# EasyEDA Pro project ProDoc_dogo-Lab_esp32c3_电激器shockerMini_V1.2_2025-11-26.epro

# Schematic Schematic3

## Sheets
1 主控部分c3: Board Name: dogo-Lab_esp32c3_电激器shockerMini_V1; Create Date: 2025-03-03; Page Name: 主控部分c3; Project Name: 都狗lab; Schematic Name: Schematic3; Update Date: 2025-11-17; Company: 嘉立创EDA; Page Size: A4; Version: V1.0
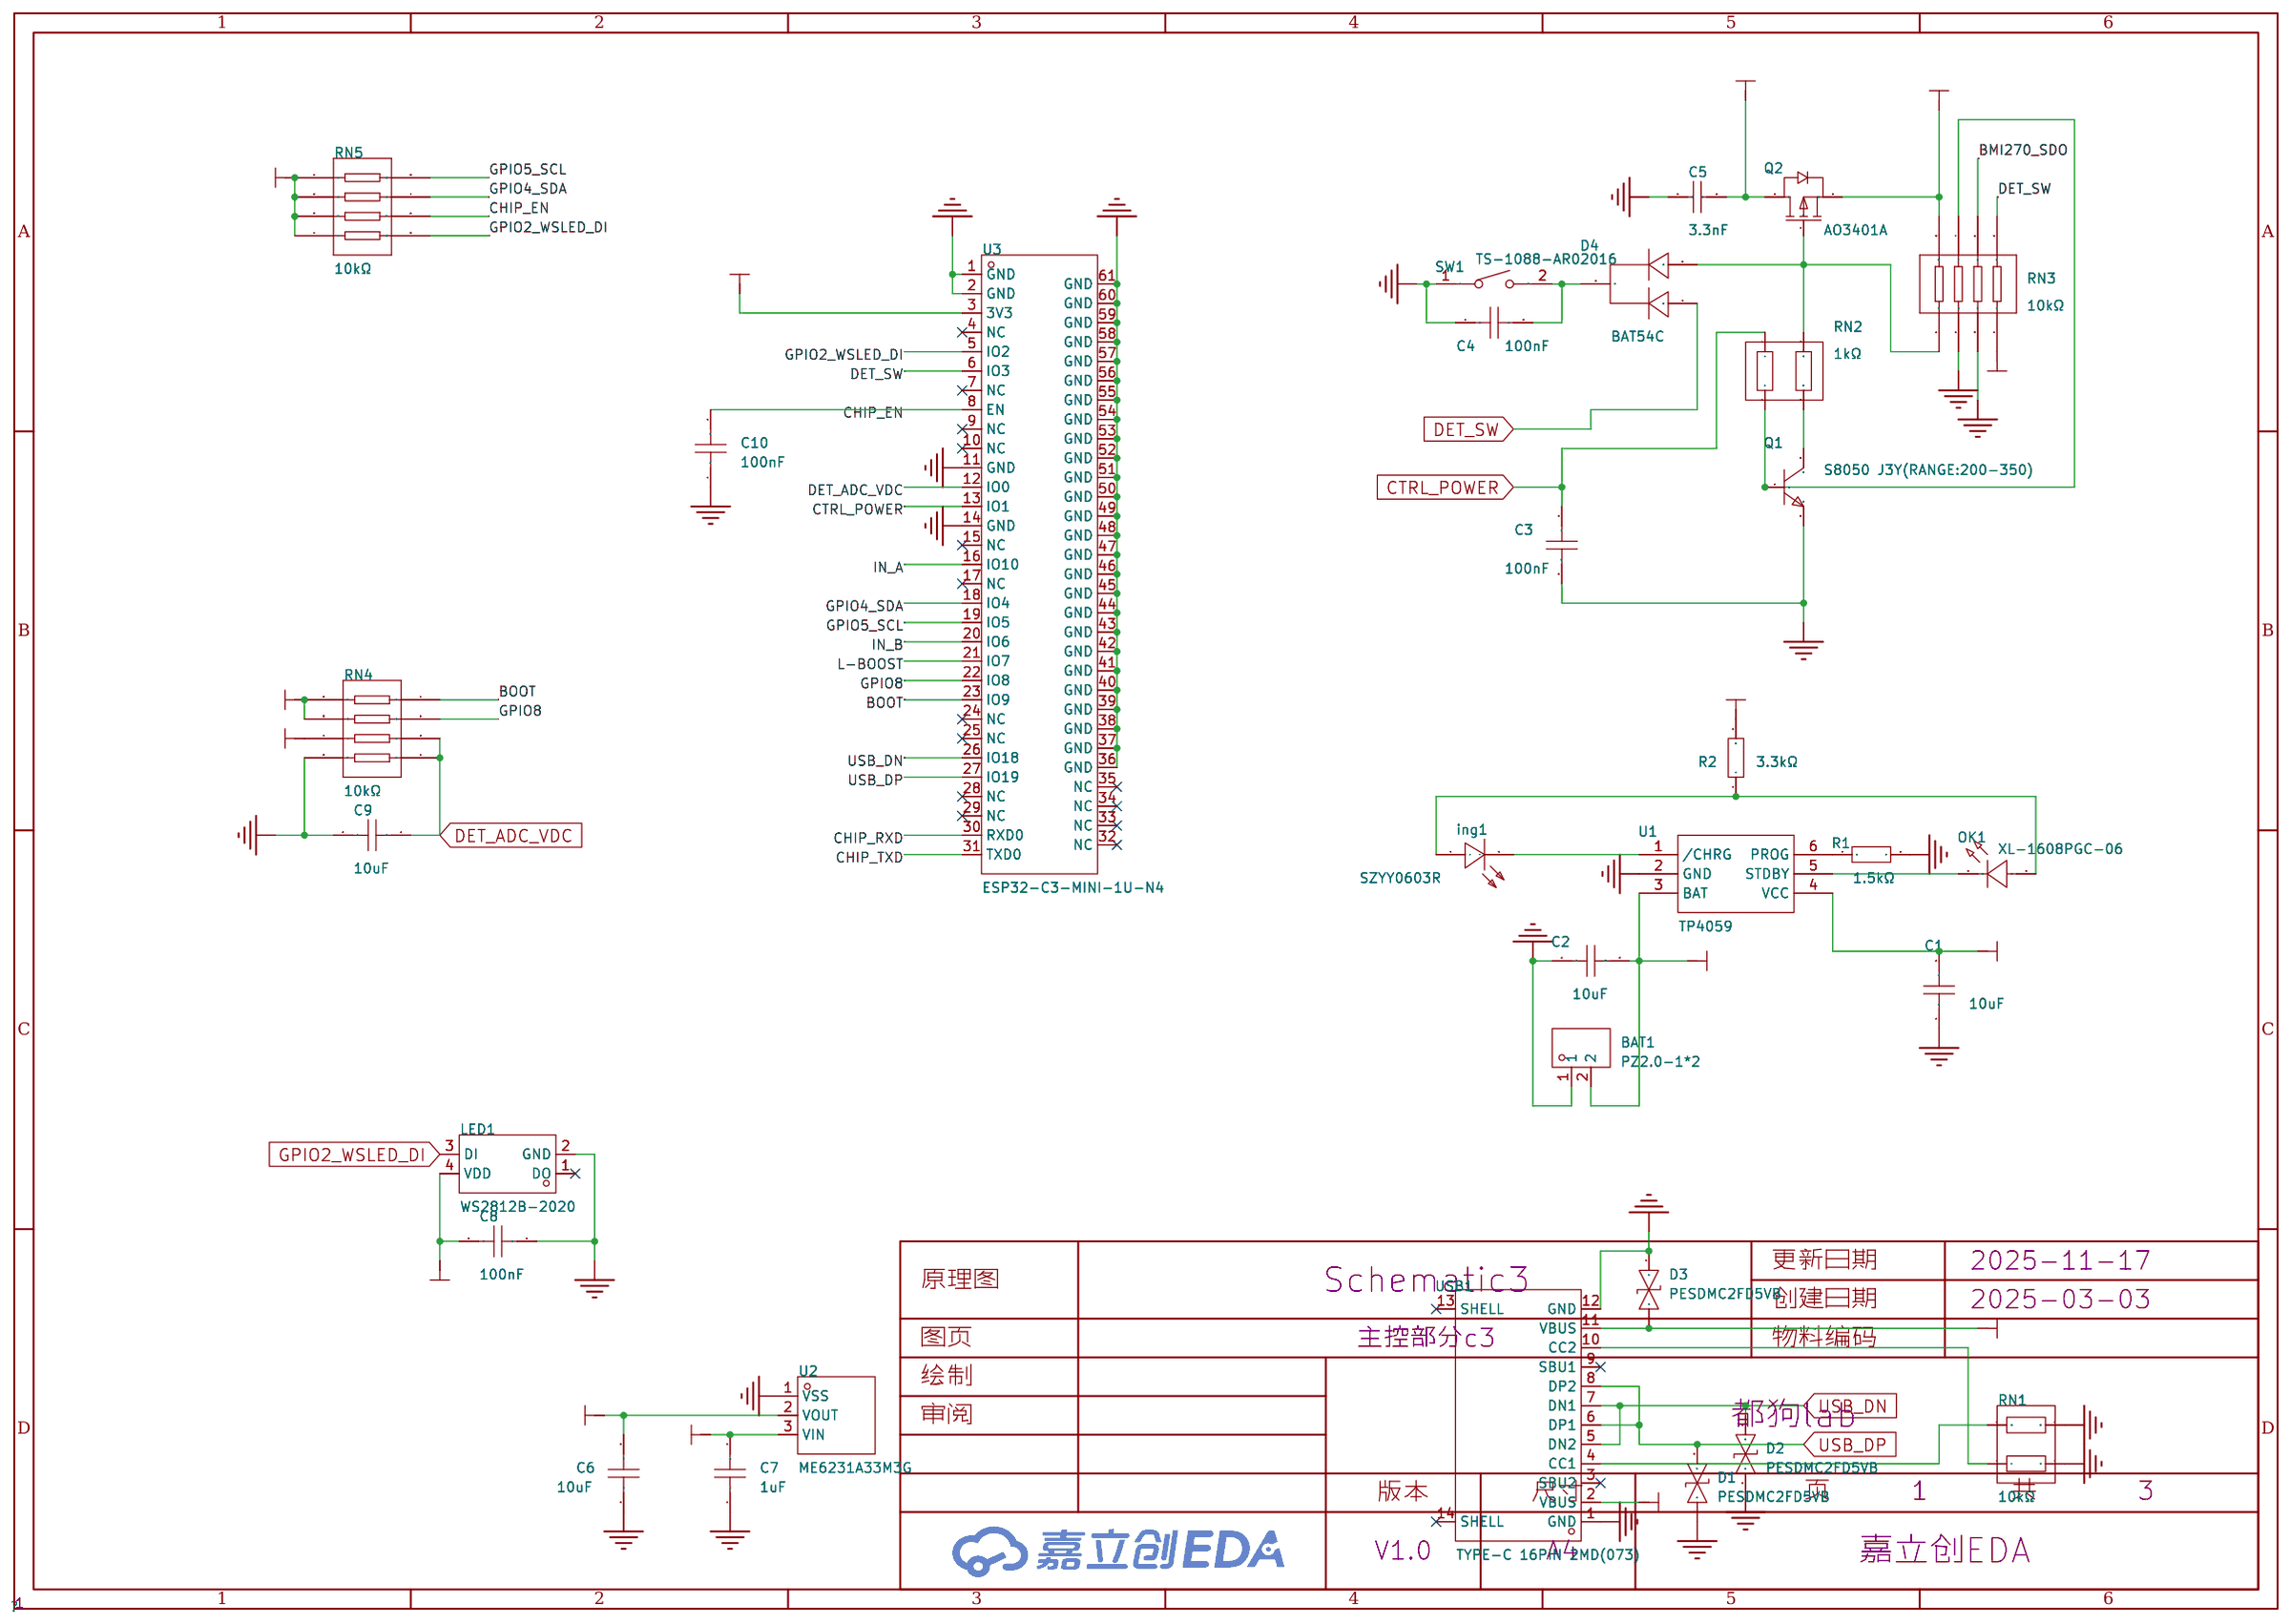
[diagram p0: 主控部分c3]
2 电刺激模块: Page Name: 电刺激模块; Update Date: 2025-04-20
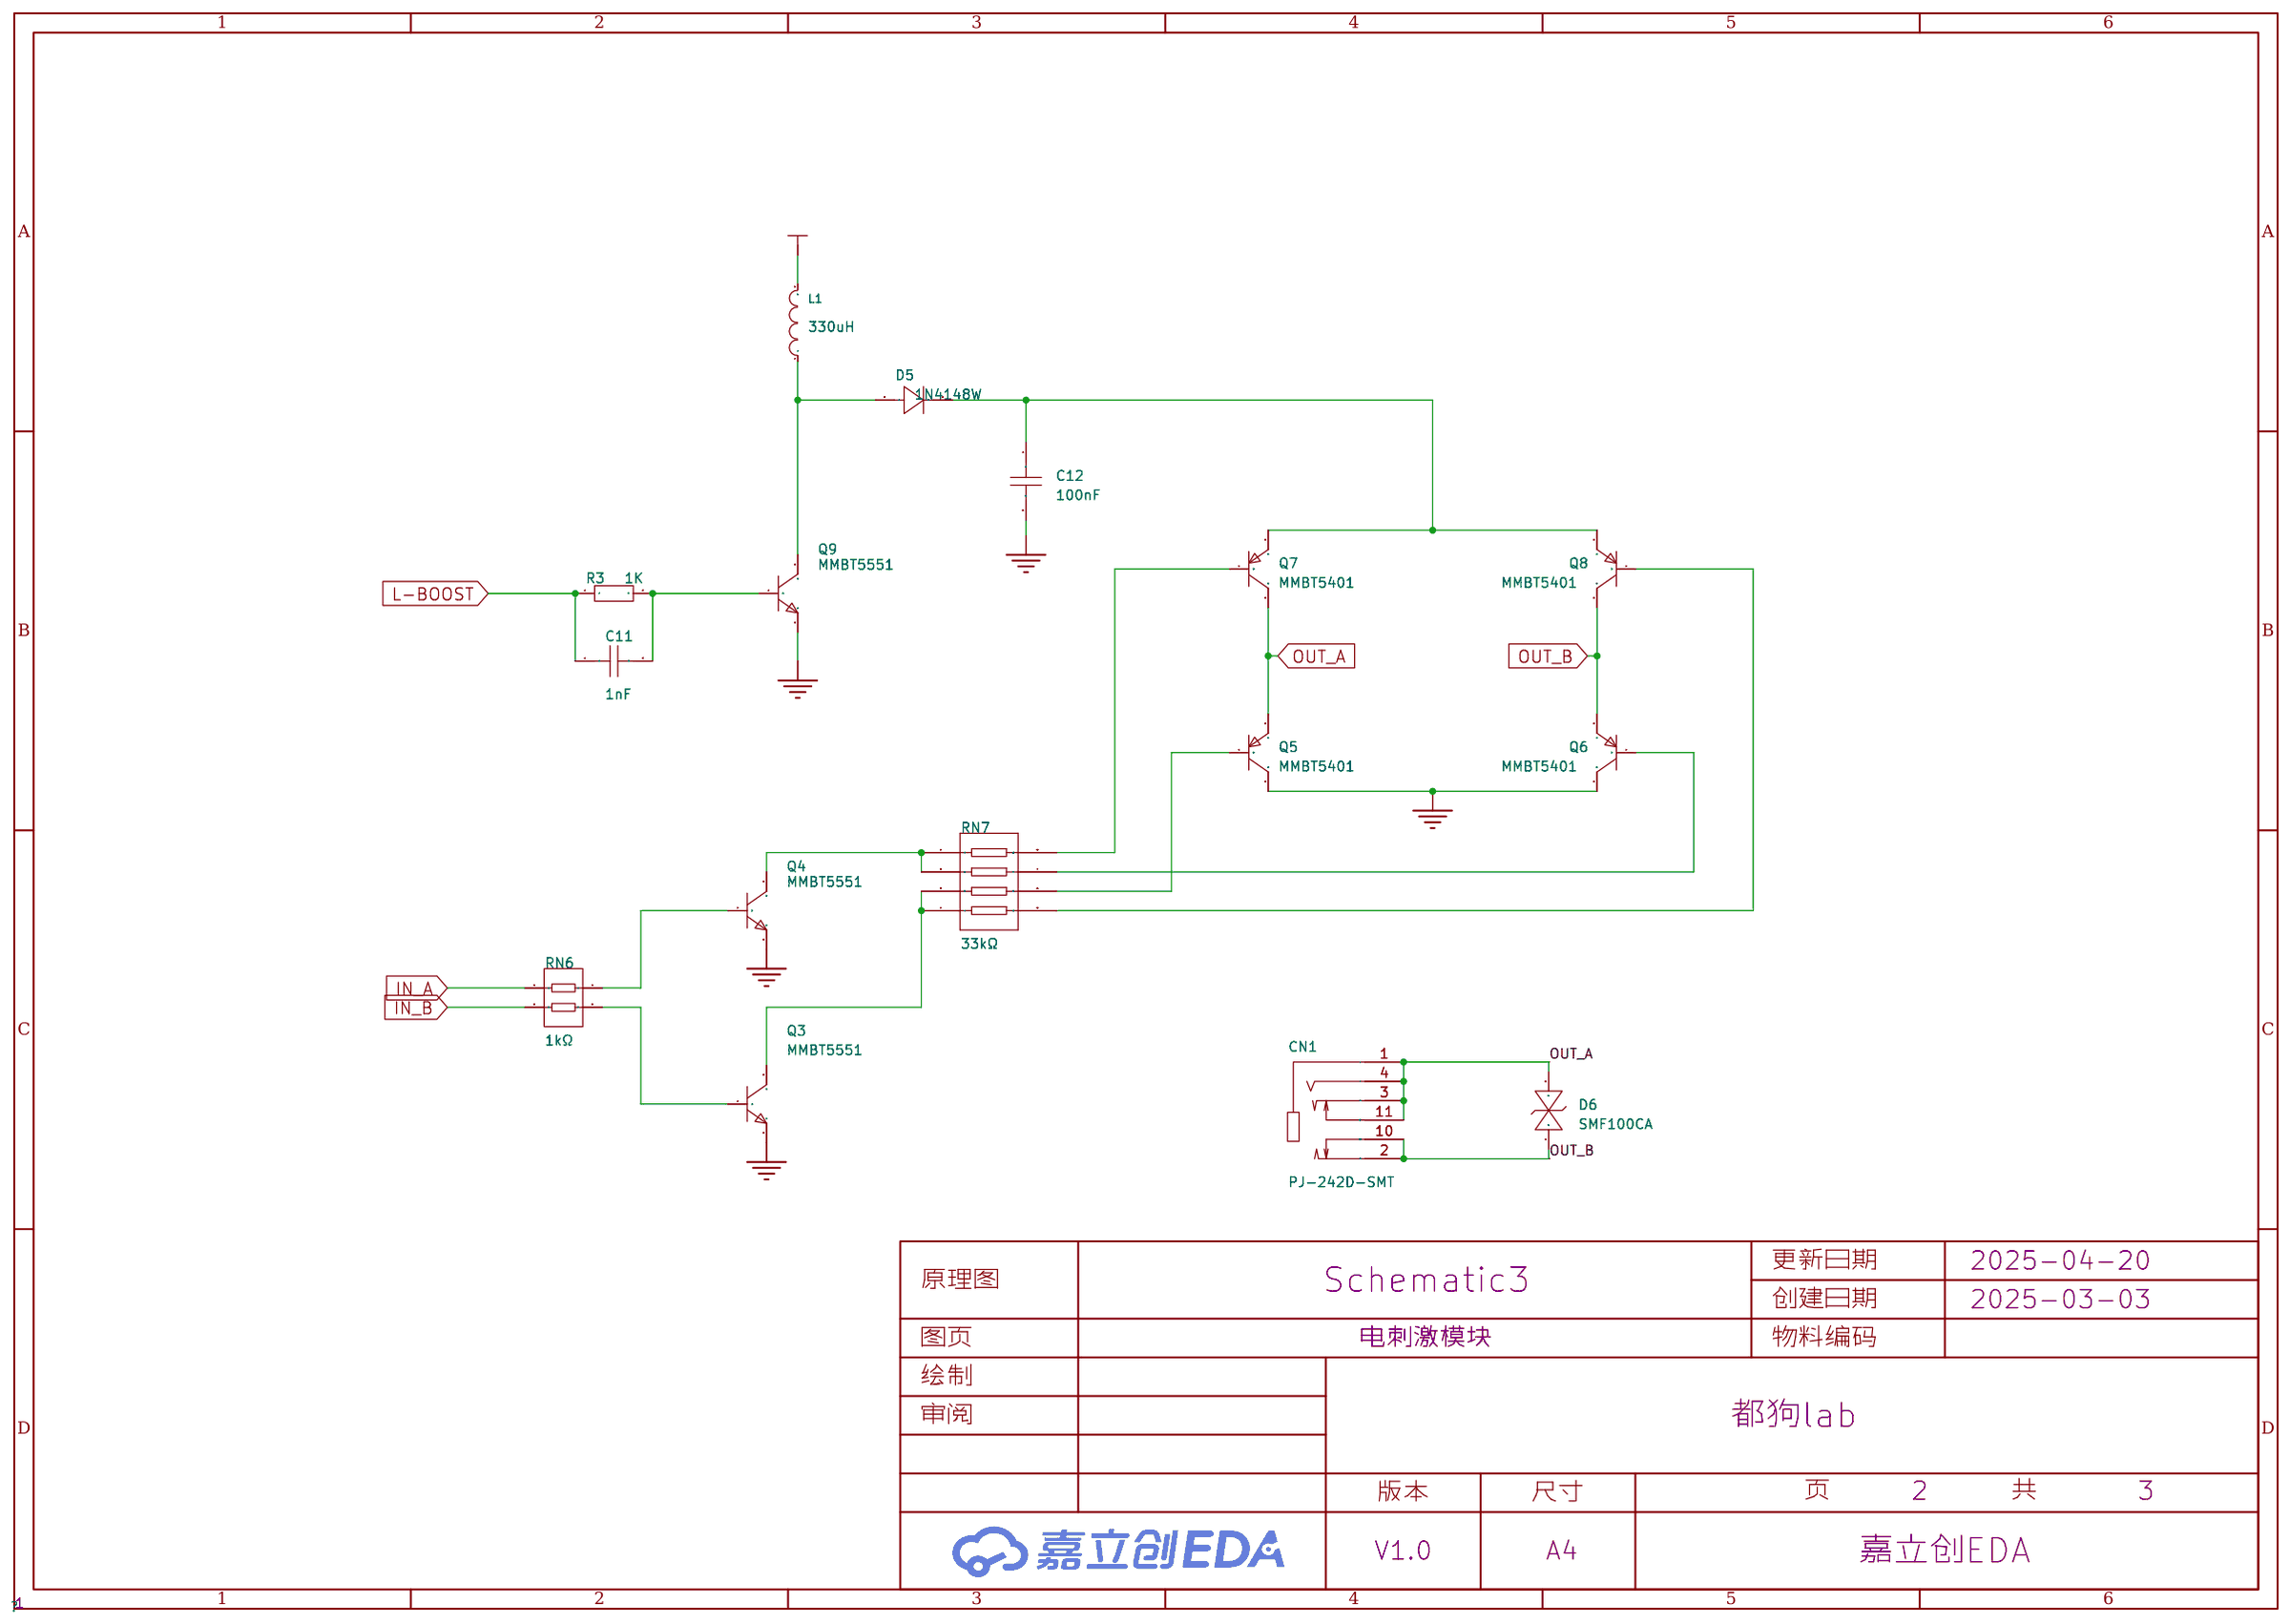
[diagram p1: 电刺激模块]
3 体动传感器: Page Name: 体动传感器; Update Date: 2025-03-03
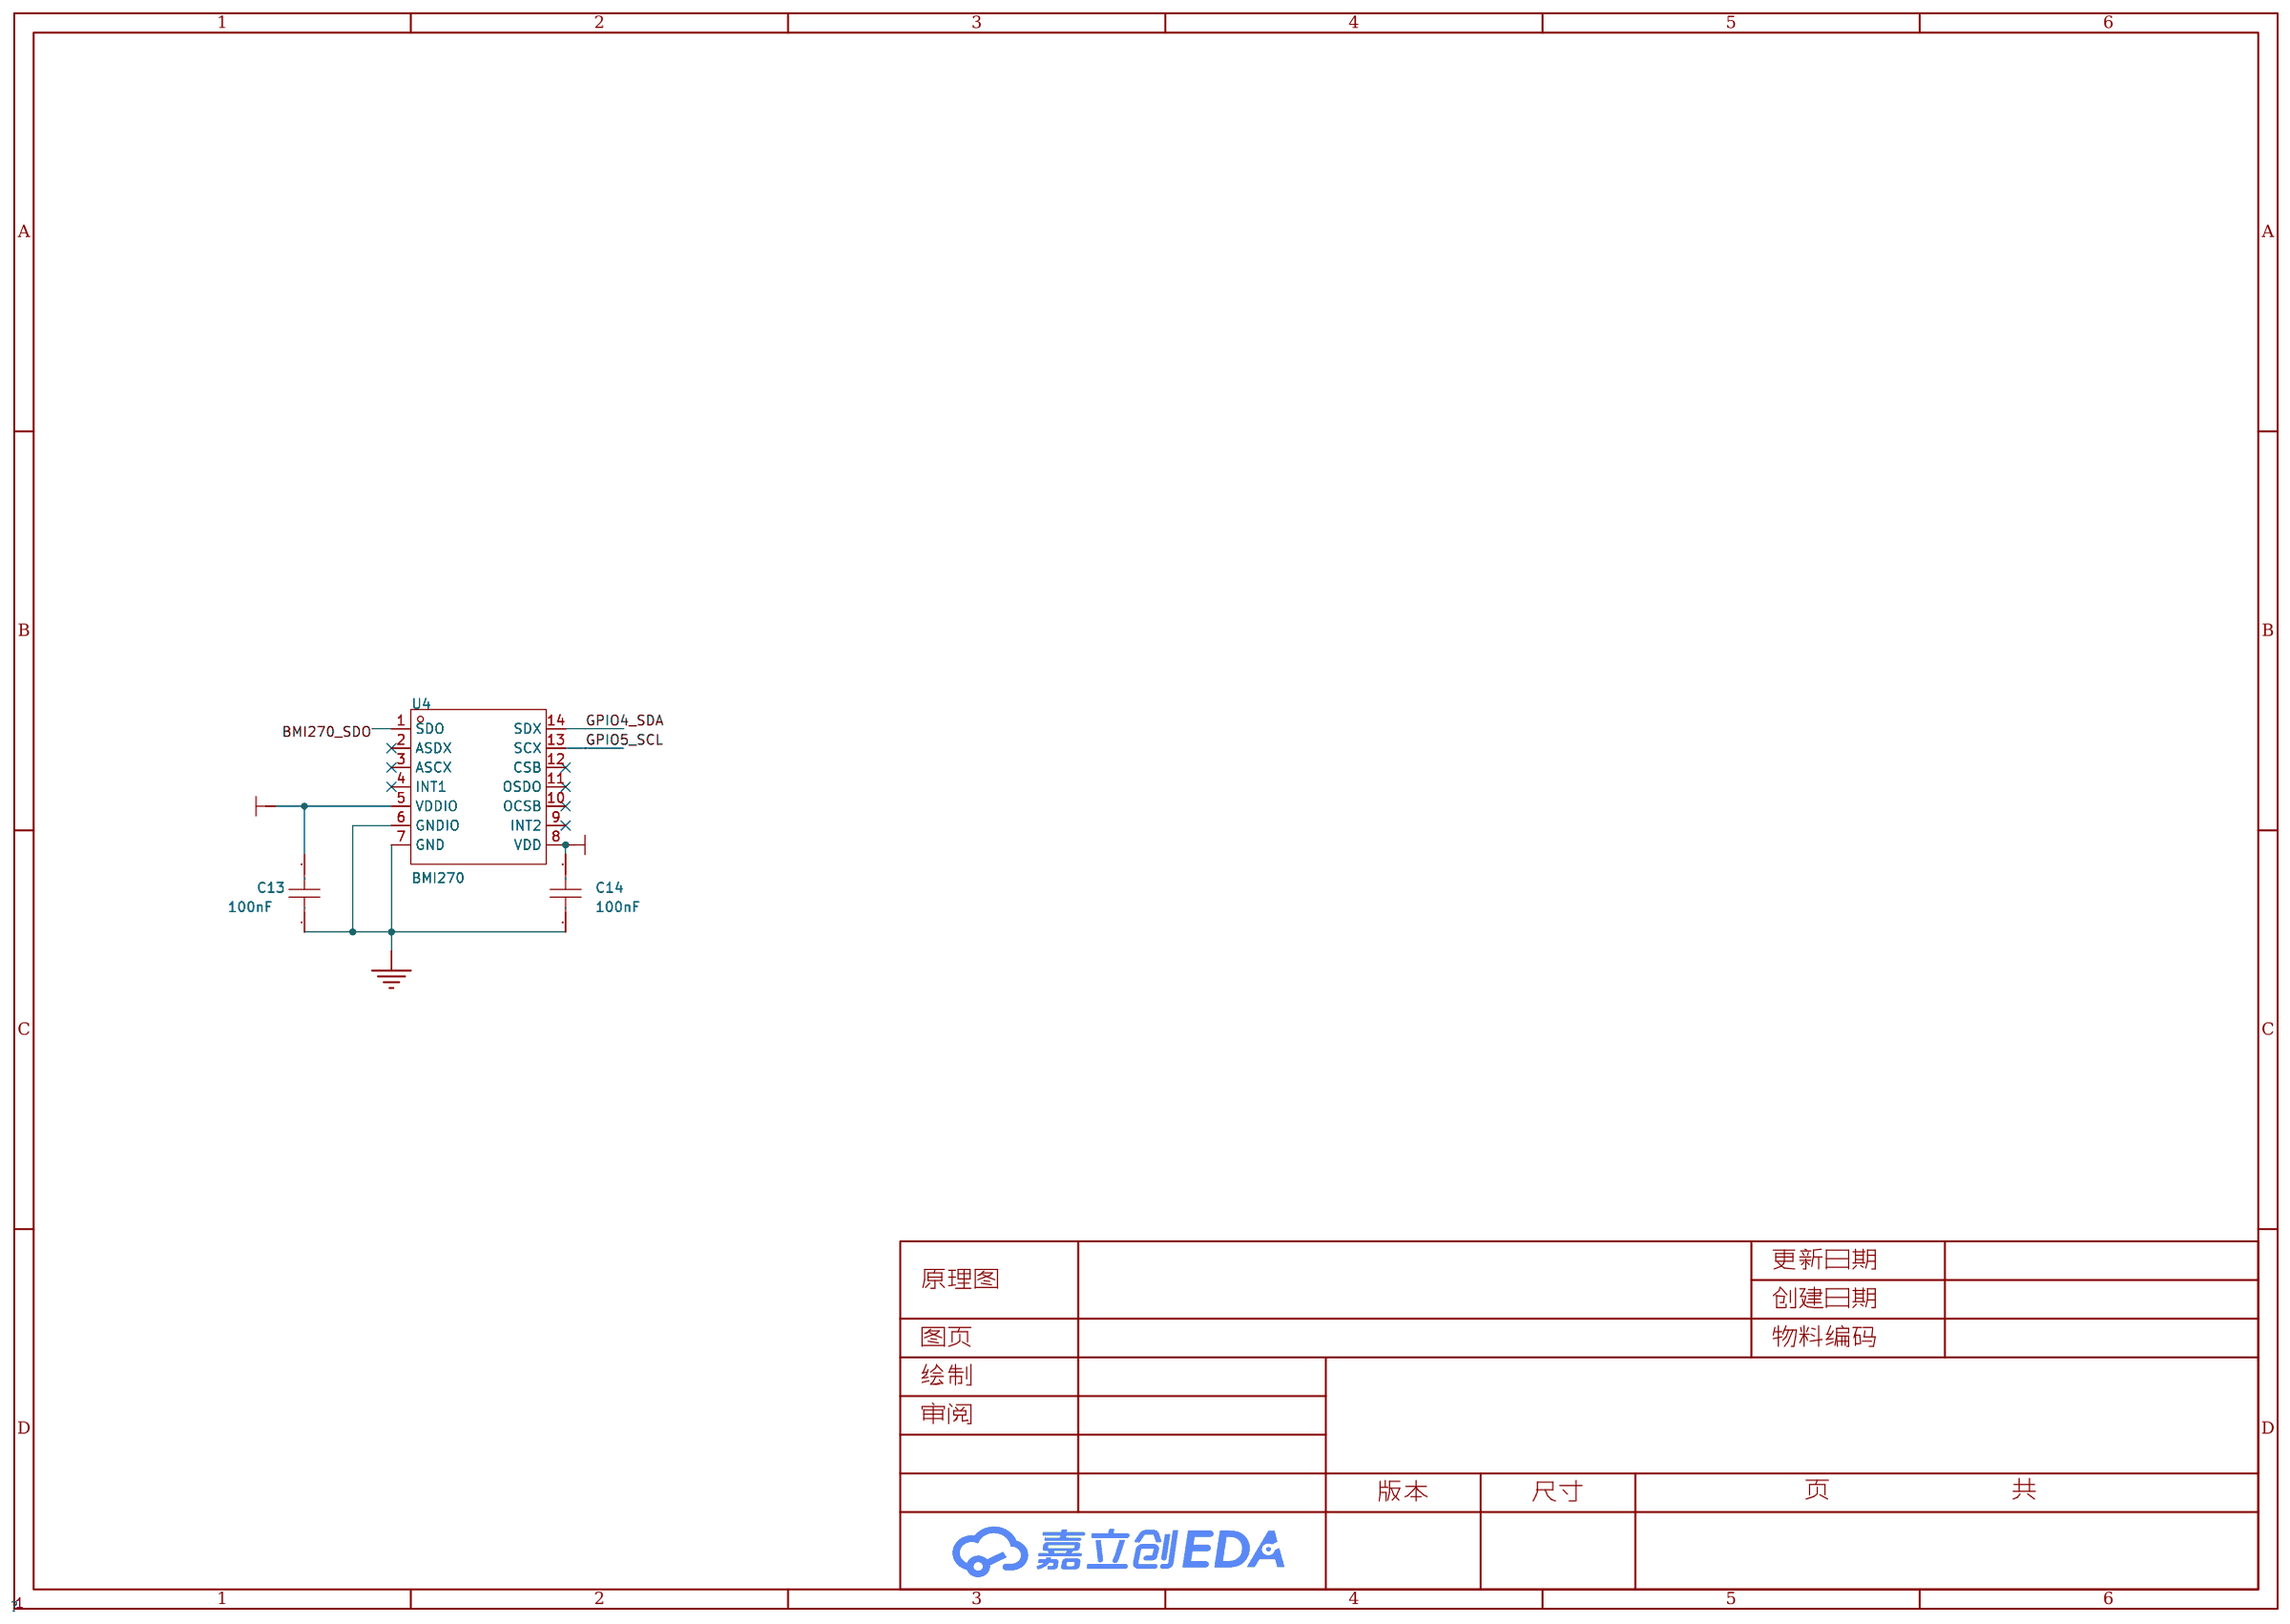
[diagram p2: 体动传感器]

## Parts
sheet 主控部分c3
BAT1  PZ2.0-1*2  [HDR-TH_2P-P2.00-V-M]
C1  10uF  [C0402]
C2  10uF  [C0402]
C3  100nF  [C0402]
C4  100nF  [C0402]
C5  3.3nF  [C0402]
C6  10uF  [C0402]
C7  1uF  [C0402]
C8  100nF  [C0402]
C9  10uF  [C0402]
C10  100nF  [C0402]
D1  PESDMC2FD5VB  [DFN1006-2L-BI]
D2  PESDMC2FD5VB  [DFN1006-2L-BI]
D3  PESDMC2FD5VB  [DFN1006-2L-BI]
D4  BAT54C  [SOT-23-3_L2.9-W1.6-P1.90-LS2.8-BR]
ing1  SZYY0603R  [LED0603-R-RD]
LED1  WS2812B-2020  [LED-SMD_4P-L2.0-W2.0-TL_WS2812B-2020]
OK1  XL-1608PGC-06  [LED0603-RD_GREEN]
Q1  S8050 J3Y(RANGE:200-350)  [SOT-23-3_L3.0-W1.7-P0.95-LS2.9-BR]
Q2  AO3401A  [SOT-23_L2.9-W1.3-P1.90-LS2.4-BR]
R1  1.5kΩ  [R0402]
R2  3.3kΩ  [R0402]
RN1  10kΩ  [RES-ARRAY-SMD_0404-4P-L1.0-W1.0-BL]
RN2  1kΩ  [RES-ARRAY-SMD_0404-4P-L1.0-W1.0-BL]
RN3  10kΩ  [RES-ARRAY-SMD_0402-8P-L2.0-W1.0-BL]
RN4  10kΩ  [RES-ARRAY-SMD_0402-8P-L2.0-W1.0-BL]
RN5  10kΩ  [RES-ARRAY-SMD_0402-8P-L2.0-W1.0-BL]
SW1  TS-1088-AR02016  [SW-SMD_L3.9-W3.0-P4.45]
U1  TP4059  [SOT-23-6_L2.9-W1.6-P0.95-LS2.8-BR]
U2  ME6231A33M3G  [SOT-23-3_L2.9-W1.6-P1.90-LS2.8-BR]
U3  ESP32-C3-MINI-1U-N4  [WIFIM-SMD_61P-L13.2-W12.5-P0.80]
USB1  TYPE-C 16PIN 2MD(073)  [USB-C-SMD_TYPE-C-6PIN-2MD-073]
sheet 体动传感器
C13  100nF  [C0402]
C14  100nF  [C0402]
U4  BMI270  [LGA-14_L3.0-W2.5-P0.50-BR]
sheet 电刺激模块
C11  1nF  [C0603]
C12  100nF  [C1206]
CN1  PJ-242D-SMT  [AUDIO-SMD_PJ-242D-SMT]
D5  1N4148W  [SOD-123_L2.8-W1.8-LS3.7-RD]
D6  SMF100CA  [SOD-123FL_L2.8-W1.8-LS3.7-BI]
L1  330uH  [IND-SMD_L4.0-W4.0_FNR40XXS]
Q3  MMBT5551  [SOT-23-3_L2.9-W1.3-P1.90-LS2.4-BR]
Q4  MMBT5551  [SOT-23-3_L2.9-W1.3-P1.90-LS2.4-BR]
Q5  MMBT5401  [SOT-23-3_L2.9-W1.3-P1.90-LS2.4-BR]
Q6  MMBT5401  [SOT-23-3_L2.9-W1.3-P1.90-LS2.4-BR]
Q7  MMBT5401  [SOT-23-3_L2.9-W1.3-P1.90-LS2.4-BR]
Q8  MMBT5401  [SOT-23-3_L2.9-W1.3-P1.90-LS2.4-BR]
Q9  MMBT5551  [SOT-23-3_L2.9-W1.3-P1.90-LS2.4-BR]
R3  1K  [R0603]
RN6  1kΩ  [RES-ARRAY-SMD_0603-4P-L1.6-W1.6-BL]
RN7  33kΩ  [RES-ARRAY-SMD_0603-8P-L3.2-W1.6-BL]

## Library data of the parts
BAT1 = PZ2.0-1*2: 插针结构:1x2P;间距:2mm;安装类型:直插;排数:单排;总PIN位数:2P;触头镀层:金;; Supplier Part: C5224022; Manufacturer: ZHOURI(洲日); Supplier Footprint: 插件,P=2mm; JLCPCB Part Class: 扩展库; Datasheet: https://atta.szlcsc.com/upload/public/pdf/source/20221031/9C5F6D49547341F15BA0B59ED41C26E6.pdf; Supplier: LCSC; Pin Structure: 1x2P; Pitch: 2mm; Mounting Type: 直插; Number of Rows: 单排; Number of Pins: 2P; Contact Plating: 金
C1 C2 C6 C9 = CL05A106MP5NUNC: 容值:10uF;精度:±20%;额定电压:10V;材质(温度系数):X5R;; LCSC Part Name: 10uF ±20% 10V; Supplier Part: C315248; Manufacturer: SAMSUNG(三星); Supplier Footprint: 0402; JLCPCB Part Class: Extended Part; Datasheet: https://atta.szlcsc.com/upload/public/pdf/source/20231220/1EF805BAE1520675928CC4638D279E74.pdf; Supplier: LCSC; Tolerance: ±20%; Voltage Rated: 10V; Temperature Coefficient: X5R
C3 C4 C8 C10 C13 C14 = CL05B104KB54PNC: 容值:100nF;精度:±10%;额定电压:50V;材质(温度系数):X7R;; LCSC Part Name: 100nF ±10% 50V; Supplier Part: C307331; Manufacturer: SAMSUNG(三星); Supplier Footprint: 0402; JLCPCB Part Class: Basic Part; Datasheet: https://atta.szlcsc.com/upload/public/pdf/source/20160218/1457707763339.pdf; Supplier: LCSC; Tolerance: ±10%; Voltage Rated: 50V; Temperature Coefficient: X7R
C5 = CL05B332KB5NNNC: 容值:3.3nF;精度:±10%;额定电压:50V;材质(温度系数):X7R;; LCSC Part Name: 3.3nF ±10% 50V; Supplier Part: C26404; Manufacturer: SAMSUNG(三星); Supplier Footprint: 0402; JLCPCB Part Class: Extended Part; Datasheet: https://atta.szlcsc.com/upload/public/pdf/source/20160218/1457707763339.pdf; Supplier: LCSC; Tolerance: ±10%; Voltage Rated: 50V; Temperature Coefficient: X7R
C7 = CL05A105KA5NQNC: 容值:1uF;精度:±10%;额定电压:25V;材质(温度系数):X5R;; LCSC Part Name: 1uF ±10% 25V; Supplier Part: C52923; Manufacturer: SAMSUNG(三星); Supplier Footprint: 0402; JLCPCB Part Class: Basic Part; Datasheet: https://atta.szlcsc.com/upload/public/pdf/source/20160218/1457707763339.pdf; Supplier: LCSC; Tolerance: ±10%; Voltage Rated: 25V; Temperature Coefficient: X5R
D1-D3 = PESDMC2FD5VB: 极性:双向;反向截止电压(Vrwm):5V;最大钳位电压:11V;峰值脉冲电流(Ipp):4A;; LCSC Part Name: 双向ESD; Supplier Part: C312241; Manufacturer: Prisemi(芯导); Supplier Footprint: DFN1006; JLCPCB Part Class: 扩展库; Datasheet: https://atta.szlcsc.com/upload/public/pdf/source/20181106/C312241_C28FA164229E0EE89FAA6B1F48225ADE.pdf; Supplier: LCSC; polarity: 双向; Reverse Stand-Off Voltage (Vrwm): 5V; Maximum Clamping Voltage: 11V; Peak Pulse Current (Ipp): 4A; Type: ESD
D4 = BAT54C_C2135: 二极管配置:-;正向压降(Vf):1V@100mA;直流反向耐压(Vr):30V;平均整流电流(Io):200mA;; LCSC Part Name: 电压:30V 电流:200mA; Supplier Part: C2135; Manufacturer: CJ(江苏长电/长晶); Supplier Footprint: SOT-23; JLCPCB Part Class: 扩展库; Datasheet: https://atta.szlcsc.com/upload/public/pdf/source/20140809/1457707206468.pdf; Supplier: LCSC; Forward Voltage (Vf@If): 1V@100mA; Reverse Voltage (Vr): 30V; Average Rectified Current (Io): 200mA
ing1 = SZYY0603R: 发光颜色:红色;功率:40mW;正向电流:20mA;主波长:615nm~630nm;二极管配置:-;透镜颜色:无色透明透镜;色温:-;发光角度:120°;载带方式:-;工作温度:-40℃~+85℃;; LCSC Part Name: 红灯; Supplier Part: C434419; Manufacturer: yongyu(永裕光电); Supplier Footprint: 0603; JLCPCB Part Class: 扩展库; Datasheet: https://atta.szlcsc.com/upload/public/pdf/source/20191204/C434419_0B955C1F73FF88449D9A795B6FF49070.pdf; Supplier: LCSC; Emitted Color: 红色; Power Dissipation: 40mW; Forward Current: 20mA; Dominant Wavelength: 615nm~630nm; Peak Wavelength: 645nm; Lens Color: 无色透明透镜; Viewing Angle: 120°; Operating Temperature: -40℃~+85℃
LED1 = WS2812B-2020: 12mA，小尺寸，高亮，用于小间距，小尺寸产品（注意防潮，请查阅规格书中对应具体内容）; LCSC Part Name: RGB三色; Supplier Part: C965555; Manufacturer: worldsemi; Supplier Footprint: SMD,2x2mm; JLCPCB Part Class: 扩展库; Datasheet: https://atta.szlcsc.com/upload/public/pdf/source/20241202/DEE3FC25B8AD87F3BB1718ACD77EDECD.pdf; Supplier: LCSC; Wavelength: 515.6nm；622.5nm；470.4nm
OK1 = XL-1608PGC-06: 灯头类型:-;发光颜色:翠绿色;正向电压(VF):2.6V~3V;功率:75mW;正向电流:5mA;主波长:505nm~540nm;二极管配置:-;透镜颜色:绿色透镜;色温:-;发光强度:299mcd;发光角度:130°;载带方式:正贴;工作温度:-;; Supplier Part: C7371905; Manufacturer: XINGLIGHT(成兴光); Supplier Footprint: 0603; JLCPCB Part Class: 扩展库; Datasheet: https://atta.szlcsc.com/upload/public/pdf/source/20240218/2F8A7AF596DEEB38157DAB7856E382C0.pdf; Supplier: LCSC; Emitted Color: 翠绿色; Forward Voltage (VF): 2.6V~3V; Power Dissipation: 75mW; Forward Current: 5mA; Dominant Wavelength: 505nm~540nm; Peak Wavelength: 530nm; Lens Color: 绿色透镜; Luminous Intensity: 299mcd; Viewing Angle: 130°; Mounting Sytle: 正贴
Q1 = S8050 J3Y(RANGE:200-350): 晶体管类型:NPN;集电极电流(Ic):500mA;集射极击穿电压(Vceo):25V;功率(Pd):300mW;直流电流增益(hFE@Ic,Vce):200@500mA,1V;; LCSC Part Name: NPN 电流:500mA 耐压:25V H档(200-350); Supplier Part: C2146; Manufacturer: CJ(江苏长电/长晶); Supplier Footprint: SOT-23; JLCPCB Part Class: 基础库; Datasheet: https://atta.szlcsc.com/upload/public/pdf/source/20231013/FF37B6A000E6CDA75C9C999D2E78731F.pdf; Supplier: LCSC; Transistor Type: NPN; Collector Current (Ic): 500mA; Collector-Emitter Breakdown Voltage (Vceo): 25V; Power Dissipation (Pd): 300mW; DC Current Gain (hFE@Ic,Vce): 200@500mA,1V; Transition Frequency (fT): 150MHz; Collector Cut-Off Current (Icbo): 100nA; Collector-Emitter Saturation Voltage (VCE(sat)@Ic,Ib): 600mV@500mA,50mA; Operating Temperature: -55℃~+150℃
Q2 = AO3401A_C347476: 类型:1个P沟道;漏源电压(Vdss):30V;连续漏极电流(Id):4.2A;导通电阻(RDS(on)@Vgs,Id):50mΩ@10V;功率(Pd):1.4W;阈值电压(Vgs(th)@Id):400mV@250uA;; LCSC Part Name: 1个P沟道 耐压:30V 电流:4.2A; Supplier Part: C347476; Manufacturer: UMW(友台半导体); Supplier Footprint: SOT-23; JLCPCB Part Class: 扩展库; Datasheet: https://atta.szlcsc.com/upload/public/pdf/source/20231109/42F312EBB081D72F04A7E8221BFFAF9D.pdf; Supplier: LCSC; Type: 1个P沟道; Drain Source Voltage (Vdss): 30V; Continuous Drain Current (Id): 4.2A; Drain Source On Resistance (RDS(on)@Vgs,Id): 50mΩ@10V; Power Dissipation (Pd): 1.4W; Gate Threshold Voltage (Vgs(th)@Id): 400mV@250uA; Total Gate Charge (Qg@Vgs): 9.4nC@4.5V; Input Capacitance (Ciss@Vds): 954pF; Reverse Transfer Capacitance (Crss@Vds): 77pF; Operating Temperature: -55℃~+150℃
R1 = RC0402FR-071K5L: 电阻类型:厚膜电阻;阻值:1.5kΩ;精度:±1%;功率:62.5mW;最大工作电压:50V;温度系数:±100ppm/℃;; LCSC Part Name: 厚膜电阻 1.5kΩ ±1% 62.5mW; Supplier Part: C114759; Manufacturer: YAGEO(国巨); Supplier Footprint: 0402; JLCPCB Part Class: Extended Part; Datasheet: https://atta.szlcsc.com/upload/public/pdf/source/20180821/C275644_0D56F95EFF785E7D9A1FEF436B37DA78.pdf; Supplier: LCSC; Type: 厚膜电阻; Tolerance: ±1%; Power(Watts): 62.5mW; Overload Voltage (Max): 50V; Temperature Coefficient: ±100ppm/℃; Operating Temperature Range: -55℃~+155℃
R2 = CR0402FF3301G: 电阻类型:厚膜电阻;阻值:3.3kΩ;精度:±1%;功率:62.5mW;最大工作电压:50V;温度系数:±200ppm/℃;; LCSC Part Name: 厚膜电阻 3.3kΩ ±1% 62.5mW; Supplier Part: C100376; Manufacturer: LIZ(丽智电子); Supplier Footprint: 0402; JLCPCB Part Class: Extended Part; Datasheet: https://atta.szlcsc.com/upload/public/pdf/source/20180403/C189438_6D658388CC7843F35BBC9018D03F0B8E.pdf; Supplier: LCSC; Type: 厚膜电阻; Tolerance: ±1%; Power(Watts): 62.5mW; Overload Voltage (Max): 50V; Temperature Coefficient: ±200ppm/℃; Operating Temperature Range: -55℃~+125℃
RN1 = YC122-JR-0710KL: 电阻器数:2;阻值:10kΩ;精度:±5%;单个元件功率:62.5mW;温度系数:±200ppm/℃;; LCSC Part Name: 10kΩ ±5%; Supplier Part: C695179; Manufacturer: YAGEO(国巨); Supplier Footprint: 0402x2; JLCPCB Part Class: 扩展库; Datasheet: https://atta.szlcsc.com/upload/public/pdf/source/20200630/C695179_C01B8AD03C65079234DFC6C85CDBB06F.pdf; Supplier: LCSC; Number of Resistors: 2; Tolerance: ±5%; Power(Watts): 62.5mW; Temperature Coefficient: ±200ppm/℃; Number of Pins: 4
RN2 = YC122-JR-071KL: 电阻器数:2;阻值:1kΩ;精度:±5%;单个元件功率:62.5mW;温度系数:±200ppm/℃;; LCSC Part Name: 1kΩ ±5%; Supplier Part: C326947; Manufacturer: YAGEO(国巨); Supplier Footprint: 0402x2; JLCPCB Part Class: 扩展库; Datasheet: https://atta.szlcsc.com/upload/public/pdf/source/20181031/C326947_4034429455513CD2DF6980A62FF4AF46.pdf; Supplier: LCSC; Number of Resistors: 2; Tolerance: ±5%; Power(Watts): 62.5mW; Temperature Coefficient: ±200ppm/℃; Number of Pins: 4
RN3-RN5 = YC124-FR-0710KL: 电阻器数:4;阻值:10kΩ;精度:±1%;单个元件功率:62.5mW;温度系数:±200ppm/℃;; LCSC Part Name: 10kΩ ±1% 0402x4; Supplier Part: C136853; Manufacturer: YAGEO(国巨); Supplier Footprint: 0402x4; JLCPCB Part Class: 扩展库; Datasheet: https://atta.szlcsc.com/upload/public/pdf/source/20180730/C256814_200CCA6CC84D78D7E49AE6680727F338.pdf; Supplier: LCSC; Number of Resistors: 4; Tolerance: ±1%; Power(Watts): 62.5mW; Temperature Coefficient: ±200ppm/℃; Number of Pins: 8
SW1 = TS-1088-AR02016: 电路结构:单刀单掷;按钮形状:圆形按钮;作用力:160gf;安装方式:立贴;开关长度:4mm;开关宽度:3mm;开关高度:2mm;带支架:不带;触点电流:50mA;额定电压(DC):12V;绝缘电阻:100MΩ;机械寿命:10万次;; LCSC Part Name: 4*3*2mm 立贴 轻触开关; Supplier Part: C720477; Manufacturer: XUNPU(讯普); Supplier Footprint: SMD; JLCPCB Part Class: 扩展库; Datasheet: https://atta.szlcsc.com/upload/public/pdf/source/20200810/C720475_60D09DD6C54279ADDB2DC25100F1CC11.pdf; Supplier: LCSC; Circuit: 单刀单掷; Actuator Style: 圆形按钮; Operating Force: 160gf; Mounting Style: 立贴; Switch Length: 4mm; Switch Width: 3mm; Switch Height: 2mm; Strike Gundam: 不带; Contact Current: 50mA; Voltage Rating (DC): 12V; Insulation Resistance: 100MΩ; Actuator/Cap Color: 黑色; Pin Style: SMD接片; Mechanical Life: 10万次; Operating Temperature: -30℃~+80℃
U1 = TP4059: 600mA 线性锂电池充电IC; Supplier Part: C80364; Manufacturer: TOPPOWER(南京拓微); Supplier Footprint: SOT-23-6; JLCPCB Part Class: 扩展库; Datasheet: https://atta.szlcsc.com/upload/public/pdf/source/20161128/1480296095027.pdf; Supplier: LCSC
U2 = ME6231A33M3G: 输出类型:固定;最大输入电压:18V;输出电压:3.3V;输出电流:500mA;电源纹波抑制比(PSRR):76dB@(100Hz);输出极性:正极;; Supplier Part: C2765181; Manufacturer: MICRONE(南京微盟); Supplier Footprint: SOT-23-3; JLCPCB Part Class: Extended Part; Datasheet: https://atta.szlcsc.com/upload/public/pdf/source/20210120/C2681684_337AAD97646491644A783A381C81CF83.pdf; Supplier: LCSC; Output Type: 固定; Maximum Input Voltage: 18V; Output Voltage: 3.3V; Output Current: 500mA; Power Supply Rejection Ratio (PSRR): 76dB@(100Hz); Feature: 短路保护；低ESR；热保护(TSD)；过流保护(OCP)；带使能; Operating Temperature: -40℃~+85℃; Output Polarity: 正极; Number of Outputs: 1
U3 = ESP32-C3-MINI-1U-N4: Supplier Part: C2911374; Manufacturer: ESPRESSIF(乐鑫); Supplier Footprint: SMD,12.5x13.2mm; JLCPCB Part Class: 扩展库; Datasheet: https://atta.szlcsc.com/upload/public/pdf/source/20220602/2F3F799AD033675D9930B69B0B580EA8.pdf; Supplier: LCSC
USB1 = TYPE-C 16PIN 2MD(073): 连接器类型:Type-C;标准:USB 3.1;公母:母;安装方式:卧贴;触点数量:16P;端口数量:1;额定电流 - 电源:5A;工作温度范围:-25℃~+85℃;; LCSC Part Name: Type-C 母 卧贴; Supplier Part: C2765186; Manufacturer: SHOU HAN(首韩); Supplier Footprint: SMD; JLCPCB Part Class: 扩展库; Datasheet: https://atta.szlcsc.com/upload/public/pdf/source/20211123/39B17C16241EAC15C5E277BDA434118E.pdf; Supplier: LCSC; Connector Type: Type-C; Standard: USB 3.1; Gender: 母; Mounting Style: 卧贴; Number of Contacts: 16P; Number of Ports: 1; Current Rating - Power (Max): 5A; Operating Temperature Range: -25℃~+85℃; Rated Voltage (Max): 5V; Connect-Disconnect Life: 5千次; Core Colour: 黑色
U4 = BMI270: 传感器类型:加速度计陀螺仪;; Supplier Part: C2836813; Manufacturer: Bosch(博世); Supplier Footprint: LGA-14(2.5x3); JLCPCB Part Class: 扩展库; Datasheet: https://atta.szlcsc.com/upload/public/pdf/source/20210625/C2836813_35E1F3F92097F45A3828DF13DDBA01A5.pdf; Supplier: LCSC; Sensor Type: 加速度计陀螺仪; Operating Temperature: -40℃~+85℃
C11 = CL10B102KC8NNNC: 容值:1nF;精度:±10%;额定电压:100V;材质(温度系数):X7R;; LCSC Part Name: 1nF ±10% 100V; Supplier Part: C153291; Manufacturer: SAMSUNG(三星); Supplier Footprint: 0603; JLCPCB Part Class: Extended Part; Datasheet: https://atta.szlcsc.com/upload/public/pdf/source/20160218/1457707763339.pdf; Supplier: LCSC; Tolerance: ±10%; Voltage Rated: 100V; Temperature Coefficient: X7R
C12 = 1206B104K101NT: 容值:100nF;精度:±10%;额定电压:100V;材质(温度系数):X7R;; LCSC Part Name: 100nF ±10% 100V; Supplier Part: C110255; Manufacturer: FH(风华); Supplier Footprint: 1206; JLCPCB Part Class: Extended Part; Datasheet: https://atta.szlcsc.com/upload/public/pdf/source/20200305/C486355_26A10D38EF8C2A5C37091D0039909270.pdf; Supplier: LCSC; Tolerance: ±10%; Voltage Rated: 100V; Temperature Coefficient: X7R
CN1 = PJ-242D-SMT: 连接器类型:2.5mm耳机座;额定电流:500mA;额定电压:30V;工作温度范围:-20℃~+70℃;焊接温度(最大值):235℃;; LCSC Part Name: 2.5mm耳机座; Supplier Part: C381133; Manufacturer: XKB Connectivity(中国星坤); Supplier Footprint: SMD; JLCPCB Part Class: 扩展库; Datasheet: https://atta.szlcsc.com/upload/public/pdf/source/20231017/7280E886D0997069091FEF77D1A28ADC.pdf; Supplier: LCSC; Connector Type: 2.5mm耳机座; Current Rating (Max): 500mA; Voltage Rating (Max): 30V; Operating Temperature Range: -20℃~+70℃; Soldering Temperature(Max): 235℃
D5 = 1N4148W_C2099: 二极管配置:独立式;正向压降(Vf):1.25V@150mA;直流反向耐压(Vr):100V;整流电流:150mA;反向恢复时间(trr):4ns;; LCSC Part Name: 丝印T4; Supplier Part: C2099; Manufacturer: CJ(江苏长电/长晶); Supplier Footprint: SOD-123; JLCPCB Part Class: Extended Part; Datasheet: https://atta.szlcsc.com/upload/public/pdf/source/20120428/1457706480199.pdf; Supplier: LCSC; Diode Configuration: 独立式; Forward Voltage (Vf@If): 1.25V@150mA; Reverse Voltage (Vr): 100V; Rectified Current: 150mA; Reverse Leakage Current: 1uA@75V; Reverse Recovery Time (trr): 4ns
D6 = SMF100CA_C726978: 极性:双向;反向截止电压(Vrwm):100V;最大钳位电压:162V;峰值脉冲电流(Ipp):1.1A;峰值脉冲功率(Ppp):200W;击穿电压:123V;; Supplier Part: C726978; Manufacturer: TWGMC(台湾迪嘉); Supplier Footprint: SOD-123FL; JLCPCB Part Class: Extended Part; Datasheet: https://atta.szlcsc.com/upload/public/pdf/source/20240221/82542CC24D3FF23C8D7724B636AB7D4B.pdf; Supplier: LCSC; polarity: 双向; Reverse Stand-Off Voltage (Vrwm): 100V; Maximum Clamping Voltage: 162V; Peak Pulse Current (Ipp): 1.1A; Peak Pulse Power Dissipation (Ppp): 200W; Breakdown Voltage: 123V; Reverse Leakage Current (Ir): 1uA; Number of Lines: 单路; Operating Temperature: -55℃~+150℃; Type: TVS
L1 = FNR4030S331MT: 电感值:330uH;精度:±20%;额定电流:260mA;饱和电流(Isat):400mA;; LCSC Part Name: 330uH ±20% 400mA; Supplier Part: C167900; Manufacturer: cjiang(长江微电); Supplier Footprint: SMD,4x4x3mm; JLCPCB Part Class: Extended Part; Datasheet: https://atta.szlcsc.com/upload/public/pdf/source/20190327/C167925_9EFF0AABC4CA629C2CC95961DBF7D39D.pdf; Supplier: LCSC; Tolerance: ±20%; Rated Current: 260mA; DC Resistance (DCR): 5.2Ω; Saturation Current (Isat): 400mA
Q3 Q4 Q9 = MMBT5551_C511877: 晶体管类型:-;集电极电流(Ic):600mA;集射极击穿电压(Vceo):160V;功率(Pd):300mW;直流电流增益(hFE@Ic,Vce):100@10mA,5V;; LCSC Part Name: 电流:600mA 耐压:160V; Supplier Part: C511877; Manufacturer: BORN(伯恩半导体); Supplier Footprint: SOT-23; JLCPCB Part Class: 扩展库; Datasheet: https://atta.szlcsc.com/upload/public/pdf/source/20200413/C511877_5FB572CA080610ED71DCB0A2B79AF8E8.pdf; Supplier: LCSC; Collector Current (Ic): 600mA; Collector-Emitter Breakdown Voltage (Vceo): 160V; Power Dissipation (Pd): 300mW; DC Current Gain (hFE@Ic,Vce): 100@10mA,5V; Transition Frequency (fT): 300MHz; Collector Cut-Off Current (Icbo): 50nA; Collector-Emitter Saturation Voltage (VCE(sat)@Ic,Ib): 200mV@50mA,5mA
Q5-Q8 = MMBT5401_C8326: 晶体管类型:PNP;集电极电流(Ic):600mA;集射极击穿电压(Vceo):150V;功率(Pd):300mW;直流电流增益(hFE@Ic,Vce):200@10mA,5V;; LCSC Part Name: PNP 电流:600mA 耐压:150V hfe=200~300; Supplier Part: C8326; Manufacturer: CJ(江苏长电/长晶); Supplier Footprint: SOT-23; JLCPCB Part Class: 基础库; Datasheet: https://atta.szlcsc.com/upload/public/pdf/source/20140809/1457707213644.pdf; Supplier: LCSC; Transistor Type: PNP; Collector Current (Ic): 600mA; Collector-Emitter Breakdown Voltage (Vceo): 150V; Power Dissipation (Pd): 300mW; DC Current Gain (hFE@Ic,Vce): 200@10mA,5V; Transition Frequency (fT): 100MHz; Collector Cut-Off Current (Icbo): 100nA; Collector-Emitter Saturation Voltage (VCE(sat)@Ic,Ib): 500mV@50mA,5mA
R3 = Res_0603: Supplier Footprint: 0603
RN6 = 2D03WGJ0102T5E: 电阻器数:2;阻值:1kΩ;精度:±5%;单个元件功率:62.5mW;温度系数:±200ppm/℃;; LCSC Part Name: 1kΩ ±5%; Supplier Part: C2769363; Manufacturer: UNI-ROYAL(厚声); Supplier Footprint: 0603x2; JLCPCB Part Class: 扩展库; Datasheet: https://atta.szlcsc.com/upload/public/pdf/source/20210330/C2758625_90D19EEA9B8C23AA9BAF71D52BD1DB3E.pdf; Supplier: LCSC; Number of Resistors: 2; Tolerance: ±5%; Power(Watts): 62.5mW; Temperature Coefficient: ±200ppm/℃; Number of Pins: 4
RN7 = 4D03WGJ0333T5E: 电阻器数:4;阻值:33kΩ;精度:±5%;单个元件功率:62.5mW;温度系数:±200ppm/℃;; LCSC Part Name: 33kΩ ±5%; Supplier Part: C25732; Manufacturer: UNI-ROYAL(厚声); Supplier Footprint: 0603x4; JLCPCB Part Class: 扩展库; Datasheet: https://atta.szlcsc.com/upload/public/pdf/source/20191224/C474318_2527498AE30E813171187CCD28401A71.pdf; Supplier: LCSC; Number of Resistors: 4; Tolerance: ±5%; Power(Watts): 62.5mW; Temperature Coefficient: ±200ppm/℃; Number of Pins: 8

## Nets
3V3: C6.2 C13.2 C14.2 RN3.4 RN4.5 RN4.6 RN5.1 RN5.2 RN5.3 RN5.4 U2.2(VOUT) U3.3(3V3) U4.5(VDDIO) U4.8(VDD)
GND: BAT1.1 C1.1 C2.1 C3.2 C4.1 C5.1 C6.1 C7.1 C8.1 C9.2 C10.1 C12.2 C13.1 C14.1 D1.1 D2.1 D3.2 LED1.2(GND) Q1.2(E) Q3.2(E) Q4.2(E) Q5.3(C) Q6.3(C) Q9.2(E) R1.2 RN1.1 RN1.2 RN3.2 RN3.3 RN4.8 SW1.1 U1.2(GND) U2.1(VSS) U3.1(GND) U3.2(GND) U3.11(GND) U3.14(GND) U3.36(GND) U3.37(GND) U3.38(GND) U3.39(GND) U3.40(GND) U3.41(GND) U3.42(GND) U3.43(GND) U3.44(GND) U3.45(GND) U3.46(GND) U3.47(GND) U3.48(GND) U3.49(GND) U3.50(GND) U3.51(GND) U3.52(GND) U3.53(GND) U3.54(GND) U3.55(GND) U3.56(GND) U3.57(GND) U3.58(GND) U3.59(GND) U3.60(GND) U3.61(GND) U4.6(GNDIO) U4.7(GND) USB1.1(GND) USB1.12(GND)
VBAT: BAT1.2 C2.2 Q2.2(S) RN3.8 U1.3(BAT)
VBUS: C1.2 D3.1 R2.2 U1.4(VCC) USB1.2(VBUS) USB1.11(VBUS)
BMI270_SDO: RN3.6 U4.1(SDO)
BOOT: RN4.4 U3.23(IO9)
CHIP_EN: C10.2 RN5.6 U3.8(EN)
CHIP_RXD: U3.30(RXD0)
CHIP_TXD: U3.31(TXD0)
CTRL_POWER: C3.1 RN2.4 U3.13(IO1)
DET_ADC_VDC: C9.1 RN4.1 RN4.2 U3.12(IO0)
DET_SW: D4.1(A1) RN3.5 U3.6(IO3)
GPIO2_WSLED_DI: LED1.3(DI) RN5.5 U3.5(IO2)
GPIO4_SDA: RN5.7 U3.18(IO4) U4.14(SDX)
GPIO5_SCL: RN5.8 U3.19(IO5) U4.13(SCX)
GPIO8: RN4.3 U3.22(IO8)
IN_A: RN6.1 U3.16(IO10)
IN_B: RN6.2 U3.20(IO6)
L-BOOST: C11.1 R3.1 U3.21(IO7)
OUT_A: CN1.1 CN1.3 CN1.4 CN1.11 D6.2 Q5.2(E) Q7.3(C)
OUT_B: CN1.2 CN1.10 D6.1 Q6.2(E) Q8.3(C)
USB_DN: D2.2 U3.26(IO18) USB1.5(DN2) USB1.7(DN1)
USB_DP: D1.2 U3.27(IO19) USB1.6(DP1) USB1.8(DP2)
VBIN: C5.2 C7.2 C8.2 L1.2 LED1.4(VDD) Q2.3(D) RN4.7 U2.3(VIN)
$1N3409: C4.2 D4.3(K) SW1.2
$1N3599: D4.2(A2) Q2.1(G) RN2.3 RN3.1
$1N4722: ing1.2(-) U1.1(/CHRG)
$1N4723: OK1.1(K) U1.5(STDBY)
$1N4725: ing1.1(+) OK1.2(A) R2.1
$1N4729: R1.1 U1.6(PROG)
$1N15751: Q1.3(C) RN2.2
$1N15823: Q1.1(B) RN2.1 RN3.7
$1N19248: RN1.4 USB1.10(CC2)
$1N19265: RN1.3 USB1.4(CC1)
$6N816: C11.2 Q9.1(B) R3.2
$6N818: C12.1 D5.1(K) Q7.2(E) Q8.2(E)
$6N827: Q4.1(B) RN6.4
$6N828: Q3.1(B) RN6.3
$6N833: D5.2(A) L1.1 Q9.3(C)
$6N1049: Q4.3(C) RN7.1 RN7.2
$6N1056: Q3.3(C) RN7.3 RN7.4
$6N1098: Q7.1(B) RN7.8
$6N1107: Q6.1(B) RN7.7
$6N1114: Q5.1(B) RN7.6
$6N1124: Q8.1(B) RN7.5

Not connected (* = marked no-connect by the designer): LED1 1(DO)*; U3 4(NC)* 7(NC)* 9(NC)* 10(NC)* 15(NC)* 17(NC)* 24(NC)* 25(NC)* 28(NC)* 29(NC)* 32(NC)* 33(NC)* 34(NC)* 35(NC)*; U4 2(ASDX)* 3(ASCX)* 4(INT1)* 9(INT2)* 10(OCSB)* 11(OSDO)* 12(CSB)*; USB1 3(SBU2)* 9(SBU1)* 13(SHELL)* 14(SHELL)*

# Board dogo-Lab_esp32c3_shockerMini_V1_2
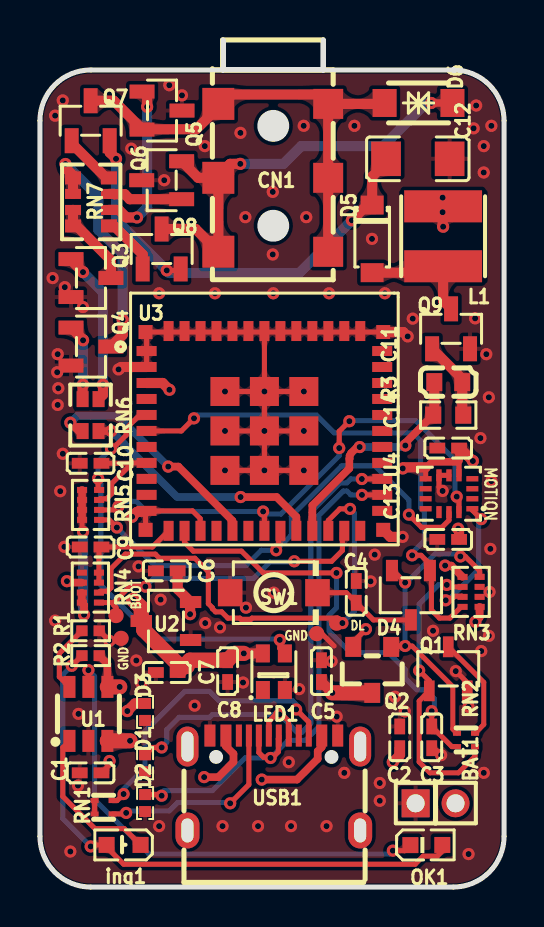
[diagram p3: board, top side]
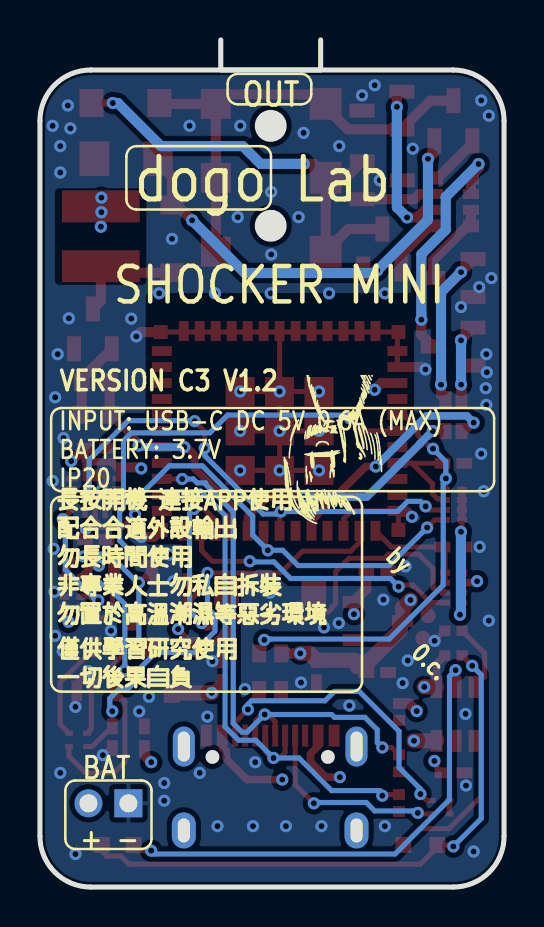
[diagram p4: board, bottom side, seen from below]

Outline 23.24 x 42.4 mm; copper layers: Top Layer, Inner1, Inner2, Bottom Layer. Coordinates in mm from the lower left corner of the outline.
Outline path: 0,38.35 0,2.54 arc(0.74,0.74) 2.54,0 20.7,0 arc(22.5,0.74) 23.24,2.54 23.24,38.35 arc(22.5,40.15) 20.7,40.89 2.54,40.89 arc(0.74,40.15) 0,38.35
Stack: Top Layer 0.035mm 外层铜厚1oz / Dielectric1 0.2104mm 7628 RC49% 8.6mil / Inner1 0.0152mm 内层铜厚 / Dielectric2 1.065mm 1.1mm H/HOZ Copper / Inner2 0.0152mm 内层铜厚 / Dielectric3 0.2104mm 7628 RC49% 8.6mil / Bottom Layer 0.035mm 外层铜厚1oz

## Design rules (mm)
net USB_DP: DP1
net USB_DN: DP1
template: 自定义配置
spacing copperThickness1oz (default): track to track 0.102, other pairs 0.152 to 0.3
spacing copperThickness2oz: track to track 0.203, other pairs 0.152 to 0.3
track width copperThickness1oz (default): min 0.127, default 0.254, max 2.54
track width copperThickness2oz: min 0.203, default 0.254, max 2.54
differential pair differentialPair (default): width min 0.127, default 0.254, max 2.54; gap min 0.152, default 0.152
via viaSize (default): diameter min 0.5, default 0.61, max 10; hole min 0.3, default 0.305, max 6.3

## Placement (name value [footprint] x y rotation side)
BAT1  PZ2.0-1*2  [HDR-TH_2P-P2.00-V-M]  19.81 4.19 0 top
C1  10uF  [C0402]  2.54 5.71 0 top
C2  10uF  [C0402]  18.02 7.49 270 top
C3  100nF  [C0402]  19.62 7.49 270 top
C4  100nF  [C0402]  15.84 14.77 270 top
C5  3.3nF  [C0402]  14.1 10.81 270 top
C6  10uF  [C0402]  6.35 15.83 0 top
C7  1uF  [C0402]  6.35 10.74 0 top
C8  100nF  [C0402]  9.4 10.81 90 top
C9  10uF  [C0402]  2.54 17.02 180 top
C10  100nF  [C0402]  2.54 21.21 0 top
C11  1nF  [C0603]  20.45 25.27 0 top
C12  100nF  [C1206]  18.92 36.45 0 top
C13  100nF  [C0402]  20.44 17.4 0 top
C14  100nF  [C0402]  20.44 21.97 0 top
CN1  PJ-242D-SMT  [AUDIO-SMD_PJ-242D-SMT]  11.68 35.5 270 top
D1  PESDMC2FD5VB  [DFN1006-2L-BI]  5.26 6.19 90 top
D2  PESDMC2FD5VB  [DFN1006-2L-BI]  5.27 4.2 90 top
D3  PESDMC2FD5VB  [DFN1006-2L-BI]  5.26 8.76 270 top
D4  BAT54C  [SOT-23-3_L2.9-W1.6-P1.90-LS2.8-BR]  18.58 14.6 90 top
D5  1N4148W  [SOD-123_L2.8-W1.8-LS3.7-RD]  16.64 32.44 270 top
D6  SMF100CA  [SOD-123FL_L2.8-W1.8-LS3.7-BI]  18.96 39.24 180 top
ing1  SZYY0603R  [LED0603-R-RD]  4.19 2.11 180 top
L1  330uH  [IND-SMD_L4.0-W4.0_FNR40XXS]  20.19 32.57 90 top
LED1  WS2812B-2020  [LED-SMD_4P-L2.0-W2.0-TL_WS2812B-2020]  11.71 10.78 90 top
NOREF  -  [Pad_e3311]  4.06 12.45 0 top
NOREF#2  -  [Pad_e1855]  3.81 13.59 0 top
NOREF#3  -  [Pad_e865]  13.86 12.68 0 top
NOREF#4  -  [Pad_e40]  14.86 13.21 0 top
OK1  XL-1608PGC-06  [LED0603-RD_GREEN]  19.35 2.1 0 top
Q1  S8050 J3Y(RANGE:200-350)  [SOT-23-3_L3.0-W1.7-P0.95-LS2.9-BR]  20.45 10.92 270 top
Q2  AO3401A  [SOT-23_L2.9-W1.3-P1.90-LS2.4-BR]  16.64 10.87 90 top
Q3  MMBT5551  [SOT-23-3_L2.9-W1.3-P1.90-LS2.4-BR]  2.56 30.48 180 top
Q4  MMBT5551  [SOT-23-3_L2.9-W1.3-P1.90-LS2.4-BR]  2.56 27.05 180 top
Q5  MMBT5401  [SOT-23-3_L2.9-W1.3-P1.90-LS2.4-BR]  6.11 38.86 180 top
Q6  MMBT5401  [SOT-23-3_L2.9-W1.3-P1.90-LS2.4-BR]  6.1 35.38 0 top
Q7  MMBT5401  [SOT-23-3_L2.9-W1.3-P1.90-LS2.4-BR]  2.54 38.35 270 top
Q8  MMBT5401  [SOT-23-3_L2.9-W1.3-P1.90-LS2.4-BR]  6.1 31.93 270 top
Q9  MMBT5551  [SOT-23-3_L2.9-W1.3-P1.90-LS2.4-BR]  20.59 27.94 270 top
R1  1.5kΩ  [R0402]  2.54 12.83 0 top
R2  3.3kΩ  [R0402]  2.54 11.58 0 top
R3  1K  [R0603]  20.45 23.62 0 top
RN1  10kΩ  [RES-ARRAY-SMD_0404-4P-L1.0-W1.0-BL]  3.19 3.99 270 top
RN2  1kΩ  [RES-ARRAY-SMD_0404-4P-L1.0-W1.0-BL]  21.34 7.36 90 top
RN3  10kΩ  [RES-ARRAY-SMD_0402-8P-L2.0-W1.0-BL]  21.59 14.77 270 top
RN4  10kΩ  [RES-ARRAY-SMD_0402-8P-L2.0-W1.0-BL]  2.53 14.99 270 top
RN5  10kΩ  [RES-ARRAY-SMD_0402-8P-L2.0-W1.0-BL]  2.54 19.13 90 top
RN6  1kΩ  [RES-ARRAY-SMD_0603-4P-L1.6-W1.6-BL]  2.54 23.62 0 top
RN7  33kΩ  [RES-ARRAY-SMD_0603-8P-L3.2-W1.6-BL]  2.56 34.29 270 top
SW1  TS-1088-AR02016  [SW-SMD_L3.9-W3.0-P4.45]  11.71 14.73 0 top
U1  TP4059  [SOT-23-6_L2.9-W1.6-P0.95-LS2.8-BR]  2.43 8.67 270 top
U2  ME6231A33M3G  [SOT-23-3_L2.9-W1.6-P1.90-LS2.8-BR]  6.31 13.31 0 top
U3  ESP32-C3-MINI-1U-N4  [WIFIM-SMD_61P-L13.2-W12.5-P0.80]  11.24 22.83 0 top
U4  BMI270  [LGA-14_L3.0-W2.5-P0.50-BR]  20.48 19.69 0 top
USB1  TYPE-C 16PIN 2MD(073)  [USB-C-SMD_TYPE-C-6PIN-2MD-073]  11.71 5.21 0 top

## Footprints (pads in the part's own frame, mm; a bottom-side part is the same pattern mirrored in y, then rotated)
AUDIO-SMD_PJ-242D-SMT
  rect 1.5x1.5 smd: 1(-3.7,2.75) 3(0,2.75) 11(3.7,2.75)
  rect 1.6x1.6 smd: 2(0,-2.75) 4(-3.7,-2.75) 10(3.7,-2.75)
C0402
  rect 0.79x0.54 smd: 1(-0.545,0) 2(0.545,0)
C0603
  rect 0.8x0.9 smd: 1(-0.7,0) 2(0.7,0)
C1206
  rect 1.485x1.728 smd: 1(-1.593,0) 2(1.593,0)
DFN1006-2L-BI
  rect 0.55x0.6 smd: 1(-0.425,0) 2(0.425,0)
HDR-TH_2P-P2.00-V-M
  rect 1.4x1.4 hole 0.9: 1(-1,0)
  round 1.4 hole 0.9: 2(1,0)
IND-SMD_L4.0-W4.0_FNR40XXS
  rect 1.6x3.9 smd: 1(-1.5,0) 2(1.5,0)
LED0603-R-RD
  rect 0.8x0.8 smd: 1(0.851,0) 2(-0.851,0)
LED0603-RD_GREEN
  rect 0.8x0.8 smd: 1(-0.799,-0.004) 2(0.799,0.004)
LED-SMD_4P-L2.0-W2.0-TL_WS2812B-2020
  rect 0.9x0.7 smd: 1(-0.915,0.55) 2(-0.915,-0.55) 3(0.915,-0.55) 4(0.915,0.55)
LGA-14_L3.0-W2.5-P0.50-BR
  rect 0.6x0.27 smd: 1(1.17,-0.75) 2(1.17,-0.25) 3(1.17,0.25) 4(1.17,0.75) 8(-1.17,0.75) 9(-1.17,0.25) 10(-1.17,-0.25) 11(-1.17,-0.75)
  rect 0.27x0.6 smd: 5(0.5,0.92) 6(0,0.92) 7(-0.5,0.92) 12(-0.5,-0.92) 13(0,-0.92) 14(0.5,-0.92)
Pad_e40
  round 0.762 smd: 1(0,0)
Pad_e865
  round 0.762 smd: 1(0,0)
Pad_e1855
  round 0.762 smd: 1(0,0)
Pad_e3311
  round 0.762 smd: 1(0,0)
R0402
  rect 0.566x0.54 smd: 1(-0.433,0) 2(0.433,0)
R0603
  rect 0.806x0.864 smd: 1(-0.753,0) 2(0.753,0)
RES-ARRAY-SMD_0402-8P-L2.0-W1.0-BL
  rect 0.3x0.505 smd: 1(-0.75,0.427) 2(-0.25,0.427) 3(0.25,0.427) 4(0.75,0.427) 5(0.75,-0.427) 6(0.25,-0.427) 7(-0.25,-0.427) 8(-0.75,-0.427)
RES-ARRAY-SMD_0404-4P-L1.0-W1.0-BL
  rect 0.25x0.4 smd: 1(-0.335,-0.45) 2(0.335,-0.45) 3(0.335,0.45) 4(-0.335,0.45)
RES-ARRAY-SMD_0603-4P-L1.6-W1.6-BL
  rect 0.6x0.8 smd: 1(-0.4,-0.8) 2(0.4,-0.8) 3(0.4,0.8) 4(-0.4,0.8)
RES-ARRAY-SMD_0603-8P-L3.2-W1.6-BL
  rect 0.65x0.8 smd: 1(-1.2,-0.9) 4(1.2,-0.9) 5(1.2,0.9) 8(-1.2,0.9)
  rect 0.5x0.8 smd: 2(-0.4,-0.9) 3(0.4,-0.9) 6(0.4,0.9) 7(-0.4,0.9)
SOD-123_L2.8-W1.8-LS3.7-RD
  rect 0.95x1.15 smd: 1(-1.692,0) 2(1.692,0)
SOD-123FL_L2.8-W1.8-LS3.7-BI
  rect 1.2x1.4 smd: 1(-1.7,0) 2(1.7,0)
SOT-23-3_L2.9-W1.3-P1.90-LS2.4-BR
  rect 1.25x0.7 smd: 1(1,-0.95) 2(1,0.95) 3(-1,0)
SOT-23-3_L2.9-W1.6-P1.90-LS2.8-BR
  rect 1.07x0.6 smd: 1(1.235,-0.95) 2(1.235,0.95) 3(-1.235,0)
SOT-23-3_L3.0-W1.7-P0.95-LS2.9-BR
  rect 1.038x0.532 smd: 1(1.101,-0.95) 2(1.101,0.95) 3(-1.101,0)
SOT-23-6_L2.9-W1.6-P0.95-LS2.8-BR
  rect 1.1x0.6 smd: 1(1.35,-0.95) 2(1.35,0) 3(1.35,0.95) 4(-1.35,0.95) 5(-1.35,0) 6(-1.35,-0.95)
SOT-23_L2.9-W1.3-P1.90-LS2.4-BR
  rect 1x0.8 smd: 1(1.15,-0.95) 2(1.15,0.95) 3(-1.15,0)
SW-SMD_L3.9-W3.0-P4.45
  rect 1.23x1.36 smd: 1(-2.185,0) 2(2.185,0)
USB-C-SMD_TYPE-C-6PIN-2MD-073
  rect 0.55x1.1 smd: 1(-3.2,2.375) 2(-2.4,2.375) 11(2.4,2.375) 12(3.2,2.375)
  rect 0.3x1.1 smd: 3(-1.75,2.375) 4(-1.25,2.375) 5(-0.75,2.375) 6(-0.25,2.375) 7(0.25,2.375) 8(0.75,2.375) 9(1.25,2.375) 10(1.75,2.375)
  oval 1.1x2 hole 0.6x1.5: 13(-4.325,1.825) 14(4.325,1.825)
  oval 1.2x1.8 hole 0.6x1.2: 13(-4.325,-2.375) 14(4.325,-2.375)
WIFIM-SMD_61P-L13.2-W12.5-P0.80
  rect 1x0.5 smd: 1(-5.9,4) 2(-5.9,3.2) 3(-5.9,2.4) 4(-5.9,1.6) 5(-5.9,0.8) 6(-5.9,0) 7(-5.9,-0.8) 8(-5.9,-1.6) 9(-5.9,-2.4) 10(-5.9,-3.2) 11(-5.9,-4) 25(5.9,-4) 26(5.9,-3.2) 27(5.9,-2.4) 28(5.9,-1.6) 29(5.9,-0.8) 30(5.9,0) 31(5.9,0.8) 32(5.9,1.6) 33(5.9,2.4) 34(5.9,3.2) 35(5.9,4)
  rect 0.5x1 smd: 12(-4.8,-5) 13(-4,-5) 14(-3.2,-5) 15(-2.4,-5) 16(-1.6,-5) 17(-0.8,-5) 18(0,-5) 19(0.8,-5) 20(1.6,-5) 21(2.4,-5) 22(3.2,-5) 23(4,-5) 24(4.8,-5) 36(4.8,5) 37(4,5) 38(3.2,5) 39(2.4,5) 40(1.6,5) 41(0.8,5) 42(0,5) 43(-0.8,5) 44(-1.6,5) 45(-2.4,5) 46(-3.2,5) 47(-4,5) 48(-4.8,5)
  rect 1.45x1.45 smd: 49(0,0) 54(-1.975,1.975) 55(0,1.975) 56(1.975,1.975) 57(1.975,0) 58(1.975,-1.975) 59(0,-1.975) 60(-1.975,-1.975) 61(-1.975,0)
  rect 0.7x0.7 smd: 50(5.95,4.95) 51(5.95,-4.95) 52(-5.95,-4.95) 53(-5.95,4.95)

## Nets
As in the schematic, except:
GND: BAT1.1 C1.1 C2.1 C3.2 C4.1 C5.1 C6.1 C7.1 C8.1 C9.2 C10.1 C12.2 C13.1 C14.1 D1.1 D2.1 D3.2 LED1.2 NOREF.1 NOREF#3.1 Q1.2 Q3.2 Q4.2 Q5.3 Q6.3 Q9.2 R1.2 RN1.1 RN1.2 RN3.2 RN3.3 RN4.8 SW1.1 U1.2 U2.1 U3.1 U3.2 U3.11 U3.14 U3.36 U3.37 U3.38 U3.39 U3.40 U3.41 U3.42 U3.43 U3.44 U3.45 U3.46 U3.47 U3.48 U3.49 U3.50 U3.51 U3.52 U3.53 U3.54 U3.55 U3.56 U3.57 U3.58 U3.59 U3.60 U3.61 U4.6 U4.7 USB1.1 USB1.12
BOOT: NOREF#2.1 RN4.4 U3.23
GPIO8: NOREF#4.1 RN4.3 U3.22

Pads without a net: LED1 1; U3 4 7 9 10 15 17 24 25 28 29 32 33 34 35; U4 2 3 4 9 10 11 12; USB1 3 9 13 14

## Via types
v1: diameter 0.61, hole 0.305, Top Layer to Bottom Layer, 179 vias

## Routing (per net, layer and track width the routed paths; a pad name or vN(x,y) marks a point on that pad's centre or on a via; arc(x,y) is an arc through that point)
3V3: length 53.9
  Top Layer w0.254: RN5.1 2.11,17.83 v1(2.16,17.78) ; v1(18.17,20.95) 18.23,21.01 ; 20.98,20.6 20.98,21.28 ; 20.99,21.35 20.92,21.28 ; 19.31,21.01 U4.8 ; 20.99,21.81 C14.2
  Top Layer w0.381: RN5.4 RN5.3 RN5.2 RN5.1 ; v1(2.21,13.63) 2.21,14.12 2.1,14.23 2.1,14.74 ; 20.99,21.81 20.99,21.35 ; v1(21.81,13.28) 22.02,13.49 RN3.4 ; 20.92,21.28 19.65,21.28 19.31,20.94
  Top Layer w0.508: 20.99,21.81 21.09,21.91 v1(21.68,21.32) ; v1(6.48,24.89) 6.14,25.23 U3.3 ; v1(7.52,13.66) 7.52,14.29 6.9,14.91 C6.2 ; 18.23,21.01 19.31,21.01 ; v1(20.94,17.94) 20.99,17.89 C13.2
  Inner2 w0.508: v1(7.52,13.66) 7.32,13.46 2.38,13.46 v1(2.21,13.63) ; 6.48,22.11 v1(6.48,24.89) ; 6.48,22.11 6.48,22.09 6.73,21.84 13.84,21.84 14.43,21.26 17.86,21.26 v1(18.17,20.95) ; 6.48,22.11 5.85,22.11 2.16,18.41 2.16,17.9 ; v1(21.68,21.32) 21.68,19.14 20.94,18.4 v1(20.94,17.94) 21.81,17.07 v1(21.81,13.28)
  Bottom Layer w0.508: v1(2.16,17.78) 2.16,13.68 v1(2.21,13.63)
GND: length 46.8
  Top Layer w0.254: v1(11.24,24.8) v1(13.22,24.8) ; v1(11.24,24.8) 11.24,27.78 ; v1(11.24,24.8) v1(11.24,22.83) ; v1(11.24,24.8) v1(9.27,24.8) ; Q1.2 21.4,10.23 v1(20.82,10.81) ; R1.2 2.98,12.83 v1(3.48,12.32) 3.94,12.32 NOREF.1 ; 11.24,27.78 U3.50 ; 11.24,27.78 U3.53 5.34,27.73 U3.1 U3.2 ; 11.24,27.78 U3.42 ; 20.48,20.6 19.98,20.6 19.98,20 v1(20.16,19.82) ; U3.14 8.04,18.08 8.02,18.1 8.02,18.44 7.64,18.83 U3.11 5.29,18.78 U3.52 ; v1(9.27,22.83) v1(11.24,22.83) ; v1(11.24,22.83) v1(11.24,20.85) ; v1(11.24,22.83) v1(13.22,22.83) ; v1(9.27,20.85) v1(11.24,20.85) ; v1(11.24,20.85) v1(13.22,20.85) ; RN1.2 RN1.1 ; C3.2 19.75,6.95 v1(20.09,6.6)
  Top Layer w0.508: v1(3.94,25.91) 4.06,26.03 U3.2 ; U3.50 18.2,27.78 v1(18.42,27.56) ; v1(18.16,17.53) 17.54,17.53 U3.51 ; 5.29,18.78 4.86,18.78 v1(4.61,18.53)
  vias: v1(0.64,30.48) v1(0.76,38.61) v1(0.76,13.33) v1(0.86,25.77) v1(0.89,26.67) v1(0.92,24.97) v1(0.89,24.13) v1(1.02,19.81) v1(1.14,39.37) v1(1.15,21.69) v1(1.24,30.02) v1(1.22,17.03) v1(1.52,1.78) v1(1.93,8.67) v1(1.91,5.08) v1(2.15,29.03) v1(4.57,36.96) v1(4.83,11.34) v1(4.94,16.05) v1(5.08,10.21) v1(5.97,29.72) v1(5.97,3.05) v1(6.04,14.38) v1(6.22,35.38) v1(6.48,40.13) v1(7.11,39.62) v1(7.75,9.08) v1(8.25,37.08) v1(8.28,13.21) v1(8.76,29.72) v1(9.02,12.99) v1(9.14,3.05) v1(10.04,37.75) v1(10.17,10.24) v1(10.29,33.53) v1(10.32,13.98) v1(10.92,3.05) v1(11.66,34.79) v1(11.66,31.66) v1(11.68,29.72) v1(11.71,14.73) v1(12.46,6.25) v1(12.57,3.05) v1(12.98,9.91) v1(13.21,38.1) v1(13.34,33.53) v1(14.35,3.05) v1(14.48,29.72) v1(14.61,11.3) v1(14.86,8.53) v1(15.24,5.71) v1(15.75,38.1) v1(16.56,15.3) v1(16.63,32.44) v1(16.76,16.64) v1(17.02,5.21) v1(17.02,4.32) v1(17.27,29.72) v1(17.78,9.52) v1(18.27,8.79) v1(18.67,28.45) v1(19.69,12.83) v1(21.46,9.02) v1(21.46,1.65) v1(21.72,37.97) v1(21.84,39.12) v1(21.79,28.46) v1(22.06,22.47) v1(22.1,11.81) v1(22.23,37.08) v1(22.22,35.76) v1(22.23,5.71) v1(22.35,26.67) v1(22.48,24.51) v1(22.55,16.93) v1(22.52,14.77) v1(22.48,12.57) v1(22.61,38.1) v1(22.61,20.32)
VBAT: length 35.9
  Top Layer w0.254: v1(16.32,12.91) 15.69,12.27 Q2.2
  Top Layer w0.381: RN3.8 20.6,16.09 v1(20.29,16.09)
  Top Layer w0.508: C2.2 18.02,6.6 v1(17.67,6.25)
  Top Layer w0.762: 3.38,7.32 3.38,7.32 v1(4.51,7.32)
  Inner2 w0.508: v1(16.32,12.91) 16.88,13.46 17.66,13.46 v1(20.29,16.09)
  Inner2 w0.762: 16.32,12.78 16.32,9.33 17.67,7.98 v1(17.67,6.25) 18.2,5.71 19.81,5.71 20.81,4.71 BAT1.2 ; 16.32,12.78 15.86,12.32 14.48,12.32 13.72,13.08 12.74,13.08 12.49,13.33 11.63,13.33 11.38,13.08 10.3,13.08 4.54,7.32 ; 16.32,12.78 v1(16.32,12.91)
VBUS: length 24.7
  Top Layer w0.254: C1.2 3.49,6.12 v1(3.49,6.31)
  Top Layer w0.381: R2.2 3.38,11.17 3.38,10.02 ; v1(8.22,5.5) 8.93,5.5 9.69,6.26 9.69,6.67 9.31,7.05 USB1.2 ; v1(11.11,5.38) 12.87,5.38 13.91,6.42 13.91,6.8 14.11,7 USB1.11
  Top Layer w0.508: D3.1 4.76,9.19 v1(4.38,8.81)
  Top Layer w0.762: v1(3.99,10.02) 3.38,10.02
  Inner2 w0.508: v1(8.22,5.5) 8.35,5.38 v1(11.11,5.38)
  Inner2 w0.762: v1(8.22,5.5) 8.22,5.5 4.25,5.5 3.19,6.56 3.19,8.14 3.85,8.81 v1(4.38,8.81) 3.99,9.19 v1(3.99,10.02)
BMI270_SDO: length 6.5
  Top Layer w0.254: v1(20.32,14.35) 20.42,14.45 20.67,14.45 20.77,14.55 21.13,14.55 RN3.6 ; U4.1 21.65,18.86 v1(22.1,18.41)
  Bottom Layer w0.254: v1(22.1,18.41) 21.97,18.29 21.97,15.89 20.55,14.47 20.44,14.47 v1(20.32,14.35)
BOOT: length 15.1
  Top Layer w0.254: v1(5.28,15.04) 5.21,15.11 4.57,15.11 3.7,14.24 ; 3.94,13.59 3.81,13.72 3.81,13.99 3.7,14.11 3.7,14.24 ; RN4.4 3.7,14.24 ; U3.23 15.15,17.73 15.15,16.84 14.61,16.3 v1(12.74,16.3)
  Bottom Layer w0.254: v1(5.28,15.04) 5.69,15.44 7.46,15.44 7.47,15.45 7.95,15.45 7.95,15.44 10.69,15.44 11.52,16.27 12.7,16.27 v1(12.74,16.3)
CHIP_EN: length 5
  Top Layer w0.254: RN5.6 3.02,19.43 3.34,19.43 3.59,19.69 3.59,20.19 4.61,21.21 ; C10.2 4.61,21.21 ; 4.61,21.21 4.62,21.23 U3.8
CTRL_POWER: length 21.9
  Top Layer w0.25: RN2.4 20.63,7.03 C3.1
  Top Layer w0.254: v1(14.85,15.72) 11.19,15.72 10.09,16.81 7.68,16.81 7.24,17.25 U3.13 ; C3.1 v1(19.62,8.8)
  Bottom Layer w0.254: v1(14.85,15.72) 14.85,13.97 14.48,13.6 14.48,12.8 15.54,11.73 17.45,11.73 18.29,10.89 18.29,10.46 18.87,9.87 19.31,9.87 19.75,9.44 19.75,8.93 v1(19.62,8.8)
DET_ADC_VDC: length 5.5
  Top Layer w0.254: U3.12 5.63,17.02 C9.1 2.96,16.89 RN4.1 RN4.2
DET_SW: length 25.9
  Top Layer w0.254: v1(7.72,23.46) 7.08,22.83 U3.6 ; 21.08,14.01 20.53,13.46 20.01,13.46 19.6,13.87 19.6,16.08 19.09,16.6 v1(18.64,16.6)
  Bottom Layer w0.254: v1(18.64,16.6) 18.64,16.73 19.25,17.34 19.25,18.79 19.06,18.98 19.06,22.34 18.67,22.73 14.73,22.73 13.84,23.62 7.88,23.62 v1(7.72,23.46)
GPIO2_WSLED_DI: length 21.3
  Top Layer w0.254: RN5.5 2.91,19.92 v1(2.91,20.45) ; U3.5 5.34,23.62 4.99,23.62 4.32,22.95 4.32,22.62 3.64,21.94 v1(3.56,21.94) ; LED1.3 12.01,11.95 v1(12.01,12.37)
  Bottom Layer w0.254: v1(3.56,21.94) 2.91,21.29 v1(2.91,20.45) 2.91,20.32 3.05,20.19 3.05,15.11 5.75,12.41 11.97,12.41 v1(12.01,12.37)
GPIO4_SDA: length 25.4
  Top Layer w0.254: U3.18 11.24,18.73 v1(11.18,18.8) ; v1(3.93,19.05) 3.75,18.88 RN5.7 ; v1(14.99,21.97) 14.99,22.81 v1(15.49,23.32) ; v1(20.87,19.54) 20.98,19.43 U4.14
  Bottom Layer w0.254: v1(3.93,19.05) 4.18,19.3 4.83,19.3 5.33,18.8 v1(11.18,18.8) 11.3,18.67 12.06,18.67 14.99,21.59 v1(14.99,21.97) ; v1(15.49,23.32) 15.52,23.34 18.82,23.34 20.78,21.39 20.78,19.63 v1(20.87,19.54)
GPIO5_SCL: length 24.4
  Top Layer w0.254: v1(11.83,16.85) 11.95,16.98 11.95,17.61 12.04,17.7 U3.19 ; v1(18.48,18.64) 19.11,18 20.13,18 20.48,18.36 U4.13 ; v1(3.85,17.99) 3.47,18.38 RN5.8
  Bottom Layer w0.254: v1(18.48,18.64) 18.48,19.37 16.76,21.08 15.11,21.08 12.59,18.56 12.59,17.61 v1(11.83,16.85) 11.08,16.85 10.32,16.09 5.76,16.09 v1(3.85,17.99)
GPIO8: length 23.9
  Top Layer w0.254: RN4.3 3.03,14.81 3.39,14.81 3.56,14.98 3.56,15.94 4.28,16.66 5.78,16.66 5.98,16.46 7.76,16.46 8.43,15.78 8.43,14.18 8.63,13.98 8.63,13.94 8.8,13.77 9.1,13.77 9.41,13.46 10.01,13.46 10.07,13.4 10.56,13.4 10.62,13.46 14.9,13.46 v1(15.15,13.21) ; v1(15.53,18.93) 15.02,18.93 14.44,18.35 U3.22
  Bottom Layer w0.254: v1(15.15,13.21) 15.75,13.81 15.75,18.71 v1(15.53,18.93)
IN_A: length 11.7
  Top Layer w0.381: U3.16 9.64,18.34 6.93,21.04 v1(6.42,21.04) ; RN6.1 1.94,22.82 v1(1.52,23.24)
  Bottom Layer w0.381: v1(1.52,23.24) 1.87,23.58 3.88,23.58 v1(6.42,21.04)
IN_B: length 12.4
  Top Layer w0.381: v1(10.05,19.52) 11.85,19.52 12.84,18.53 U3.20 ; RN6.2 v1(3.57,22.82)
  Bottom Layer w0.381: v1(10.05,19.52) 6.87,19.52 4.21,22.19 4.21,22.2 3.83,22.58 3.81,22.58 v1(3.57,22.82)
L-BOOST: length 11.3
  Top Layer w0.381: v1(16.01,22.02) 15.88,22.02 15.58,21.72 arc(15.55,21.65) 15.51,21.59 15.51,21.45 15.49,21.44 15.49,20.95 13.64,19.1 U3.21 ; v1(18.3,22.1) 18.3,22.23 19.69,23.62 R3.1
  Top Layer w0.508: R3.1 19.75,23.68 C11.1
  Bottom Layer w0.381: v1(16.01,22.02) 18.22,22.02 v1(18.3,22.1)
OUT_A: length 23.8
  Top Layer w0.254: 5.12,37.93 Q5.2
  Top Layer w0.508: CN1.1 13.97,39.67 9.4,39.67 CN1.4 8.93,39.03 7.83,37.93 5.12,37.93 3.7,39.35 Q7.3 ; CN1.1 17.21,39.2 D6.2 ; CN1.1 CN1.3 CN1.11
OUT_B: length 22.5
  Top Layer w0.381: v1(19.59,39.24) D6.1
  Top Layer w0.508: CN1.2 8.93,35.6 9.53,36.19 v1(10.03,36.19) ; CN1.2 CN1.10 7.8,32.93 Q8.3 ; CN1.2 7.93,35.5 Q6.2
  Bottom Layer w0.508: v1(10.03,36.19) 12.19,36.19 13.08,37.08 17.18,37.08 19.34,39.24 v1(19.59,39.24)
USB_DN: length 27.5
  Top Layer w0.254: USB1.7 11.96,7.45 11.94,7.43 11.94,6.77 11.63,6.46 v1(11.55,6.46) 11.51,6.5 11.19,6.5 10.96,6.73 USB1.5 ; D2.2 6.04,4.63 v1(6.1,4.57) ; U3.26 v1(16.12,19.63)
  Bottom Layer w0.254: v1(16.12,19.63) 15.57,19.63 15.37,19.82 15.19,19.82 13.97,18.6 13.97,8.02 13.29,7.34 12.43,7.34 v1(11.55,6.46) 10.27,6.46 8.64,4.83 6.22,4.83 6.1,4.7 v1(6.1,4.57)
USB_DP: length 27.7
  Top Layer w0.254: U3.27 16.12,20.43 v1(16.12,20.42) ; v1(6.1,6.98) 5.63,6.98 D1.2 ; USB1.6 11.46,8.29 11.81,8.64 v1(11.99,8.64) 11.99,8.64 12.13,8.64 12.45,8.32 12.45,7.72 12.46,7.71 USB1.8
  Bottom Layer w0.254: v1(16.12,20.42) 15.56,20.42 15.37,20.23 14.94,20.23 14.94,20.22 14.98,20.19 13.56,18.77 13.56,8.19 13.12,7.75 12.87,7.75 v1(11.99,8.64) 8.64,8.64 8.5,8.49 6.97,8.49 6.35,7.87 6.35,7.24 v1(6.1,6.98)
VBIN: length 54.8
  Top Layer w0.381: 2.1,15.24 1.42,15.24 v1(1.35,15.31)
  Top Layer w0.508: v1(20.19,33.05) 20.16,33.08 v1(20.16,33.78) ; v1(14.64,9.72) C5.2 ; LED1.4 v1(10.21,11.69)
  Top Layer w0.762: Q2.3 v1(14.64,9.72) ; 7.24,11.08 7,10.84 ; 7.24,11.08 7.51,11.35 C8.2 9.74,11.69 v1(10.21,11.69) ; 7.24,11.08 7.28,11.04 7.37,11.04 ; 7.24,11.08 6.98,11.08 5.2,12.86 5.2,13.19 U2.3 5.07,13.98 v1(4.69,14.37)
  Inner2 w0.508: 3.8,15.31 v1(1.35,15.31) ; v1(20.19,33.05) 20.16,33.08 v1(20.16,33.78) v1(20.16,34.51)
  Inner2 w0.762: v1(10.21,11.69) 11.11,10.8 13.56,10.8 v1(14.64,9.72) ; v1(4.69,14.37) 3.8,15.25 3.8,15.31 3.8,15.31 3.8,16.24 5.25,17.69 11.47,17.69 11.86,18.08 16.53,18.08 19.94,21.48 19.94,32.8 v1(20.19,33.05)
$1N3409: length 5.2
  Top Layer w0.254: SW1.2 15.34,14.73 C4.2 16.7,13.37 D4.3
$1N3599: length 15.8
  Top Layer w0.25: RN2.3 20.67,7.91 20.67,10.03 18.64,12.06
  Top Layer w0.254: v1(18.29,12.06) 17.93,12.06 17.92,12.06 ; v1(18.29,15.24) 17.69,15.84 D4.2 ; 17.92,12.06 17.63,12.06 Q2.1 ; 17.92,12.06 18.64,12.06 ; RN3.1 22.02,15.83 21.3,16.55 v1(21.05,16.55)
  Bottom Layer w0.254: v1(18.29,12.06) v1(18.29,15.24) 18.36,15.24 19.79,16.67 20.93,16.67 v1(21.05,16.55)
$1N4722: length 7.8
  Top Layer w0.254: ing1.2 4.23,2.92 2.75,2.92 1.14,4.53 1.14,6.98 U1.1
$1N4723: length 24.6
  Top Layer w0.254: OK1.1 18.27,1.82 v1(17.67,1.82) ; U1.5 v1(2.43,10.86)
  Bottom Layer w0.254: v1(17.67,1.82) 17.5,1.65 5.46,1.65 2.74,4.38 2.74,10.55 v1(2.43,10.86)
$1N4725: length 29.3
  Top Layer w0.254: 3.23,2.11 4.19,1.14 18.79,1.14 19.19,1.55 19.9,1.55 20.15,1.8 OK1.2 ; 3.23,2.11 3.34,2.11 ; 3.23,2.11 2.62,2.11 v1(2.54,2.03) ; v1(1.59,11.07) R2.1
  Bottom Layer w0.254: v1(1.59,11.07) 1.14,10.62 1.14,3.43 v1(2.54,2.03)
$1N4729: length 3.5
  Top Layer w0.254: R1.1 0.97,11.69 0.97,10.52 U1.6
$1N15751: length 5.2
  Top Layer w0.25: Q1.3 22.23,10.25 22.23,8.14 RN2.2
$1N15823: length 14.8
  Top Layer w0.25: RN2.1 21.78,6.54 20.95,5.71 19.53,5.71 18.99,6.26 18.99,9.31 Q1.1
  Top Layer w0.254: v1(20.37,15.12) 20.47,15.02 RN3.7 ; v1(18.99,10.84) 19.5,10.33 Q1.1
  Bottom Layer w0.254: v1(18.99,10.84) 18.99,14.16 19.95,15.12 v1(20.37,15.12)
$1N19248: length 14.8
  Top Layer w0.254: v1(12.83,8.89) 13.46,8.26 USB1.10 ; v1(4.19,4.66) 3.86,4.33 RN1.4
  Bottom Layer w0.254: v1(4.19,4.66) 4.19,4.91 5.26,5.98 5.26,7.8 7.25,9.79 8.5,9.79 8.97,9.32 12.65,9.32 12.83,9.14 v1(12.83,8.89)
$1N19265: length 9.9
  Top Layer w0.254: v1(9.53,4.19) 10.46,5.13 USB1.4 ; RN1.3 4.27,3.66 v1(4.32,3.71)
  Bottom Layer w0.254: v1(4.32,3.71) 4.42,3.81 6.48,3.81 6.9,4.23 9.48,4.23 v1(9.53,4.19)
$6N816: length 4
  Top Layer w0.508: R3.2 21.15,23.68 C11.2 21.15,25.43 Q9.1
$6N818: length 22.8
  Top Layer w0.254: v1(6.35,30.86) 6.97,30.86 7.05,30.93
  Top Layer w0.508: v1(3.81,36.45) 3.49,36.77 Q7.2 ; v1(15.62,33.37) 16.38,34.13 D5.1 16.64,35.56 17.33,36.25 C12.1
  Bottom Layer w0.508: v1(3.81,36.45) 3.81,33.4 v1(6.35,30.86) 6.48,30.73 12.98,30.73 v1(15.62,33.37)
$6N827: length 3.8
  Top Layer w0.508: RN6.4 2.14,25.13 v1(2.15,25.15) ; 1.56,28 2.16,27.4 v1(2.16,27.37)
  Bottom Layer w0.508: v1(2.16,27.37) 2.15,27.36 v1(2.15,25.15)
$6N828: length 7.8
  Top Layer w0.508: v1(2.16,30.78) 1.56,31.38 Q3.1 ; RN6.3 3.16,24.64 v1(3.16,25.15)
  Bottom Layer w0.508: v1(2.16,30.78) 3.16,29.78 v1(3.16,25.15)
$6N833: length 5.9
  Top Layer w0.508: D5.2 19.93,30.75 20.19,31.01 20.19,29.34 Q9.3
$6N1049: length 12.2
  Top Layer w0.508: v1(1.28,36.19) 1.28,36.06 1.27,36.05 1.27,36 1.66,35.62 RN7.1 RN7.2 ; Q4.3 4.14,27.64 v1(4.14,28.4)
  Bottom Layer w0.508: v1(1.28,36.19) 2.92,34.54 2.92,32.89 4.14,31.67 v1(4.14,28.4)
$6N1056: length 4.3
  Top Layer w0.508: Q3.3 3.56,31.37 1.84,33.09 RN7.4 RN7.3
$6N1098: length 2.7
  Top Layer w0.508: 1.59,37.35 1.59,37.22 3.32,35.49 RN7.8
$6N1107: length 3.7
  Top Layer w0.508: RN7.7 3.71,34.69 3.73,34.67 4.25,34.67 4.5,34.43 Q6.1
$6N1114: length 8.2
  Top Layer w0.508: RN7.6 3.96,33.89 4.33,33.51 v1(4.86,33.51) ; v1(5.37,39.05) 5.37,39.56 Q5.1
  Bottom Layer w0.508: v1(5.37,39.05) 5.37,34.02 v1(4.86,33.51)
$6N1124: length 3
  Top Layer w0.508: RN7.5 3.71,33.09 5.15,31.66 Q8.1

## Copper pours and planes (outline as drawn; the poured copper is in the pictures)
GND on Top Layer: -1.14,43.43 27.05,43.43 27.05,-1.65 -1.14,-1.65
GND on Bottom Layer: -4.95,44.07 26.42,44.07 26.42,-0.89 -4.95,-0.89
GND on Inner1: 0.26,40.64 22.98,40.64 22.98,0.26 0.26,0.26
GND on Inner2: -6.1,42.42 32,42.42 32,-4.57 -6.1,-4.57

Small or netless copper shapes (teardrops, artwork), in the pictures only: 287 on Top Layer, 63 on Bottom Layer, 3 on Inner1, 21 on Inner2

## Text on the board
Bottom Silkscreen Layer: 0.c. | by | INPUT: USB-C DC 5V 0.6A (MAX) / BATTERY: 3.7V / IP20 | VERSION C3 V1.2 | + - | BAT | OUT | SHOCKER MINI | dogo Lab | 長按開機 連接APP使用 / 配合合適外設輸出 / 勿長時間使用 / 非專業人士勿私自拆裝 / 勿置於高溫潮濕等惡劣環境 | 僅供學習研究使用 / 一切後果自負
Top Silkscreen Layer: BOOT | GND | DL | MOTION
